# Altium project UL-SWAP-DAQ-1.PrjPcb (part 1 of 2)
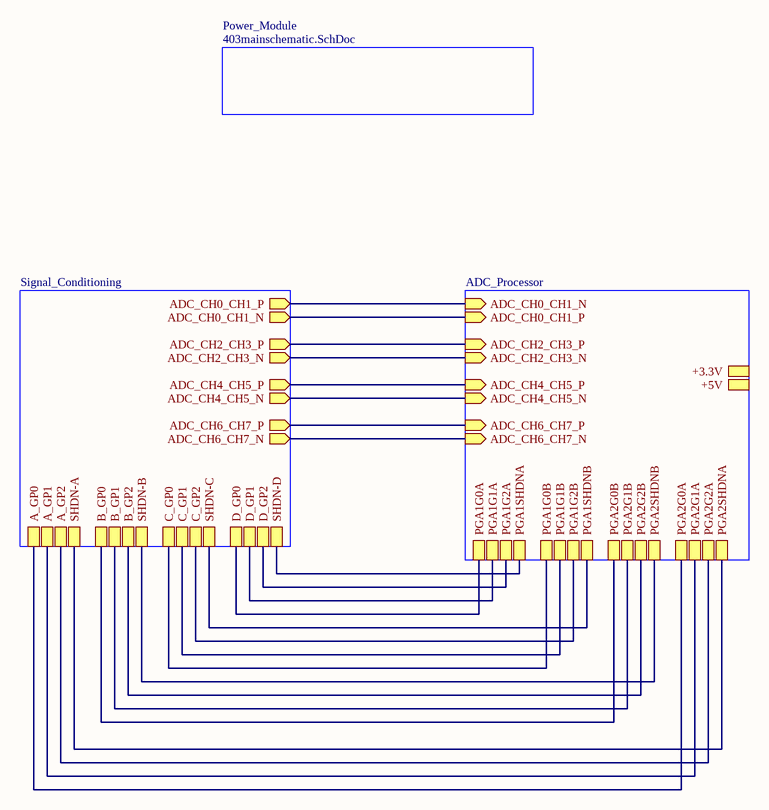
[diagram p0: UL-SWAP-DaQ-Schematic.SchDoc]
14 sheets, 121 parts. Net scope: hierarchical (ports join the sheet entries above them; power ports are global).
Board files: ADC_PIC32_LVDS_DRIVER_Subsystem.PcbDoc, pcb403.PcbDoc, Capstone_Signal_Conditioning_Subsystem_Test_PCB.PcbDoc, UL-SWAP-DAQ-1.PcbDoc
Sheets:
  UL-SWAP-DaQ-Schematic.SchDoc
    Signal_Conditioning = Capstone_Signal_Conditioners_Subsystem_Test_Schematic.SchDoc
      PGA1 = THS7002CPWP_Schematic.SchDoc
      Diff_Amp_1 = LTC6362_Schematic.SchDoc
      PGA2 = THS7002CPWP_Schematic_2.SchDoc
      Diff_Amp_2 = LTC6362_Schematic_2.SchDoc
    ADC_Processor = ADC_PIC32_LVDS_DRIVER_Subsystem.SchDoc
      ADC_Subsystem = ADC_Subsystem.SchDoc
      PIC32_Subsystem = PIC32_Subsystem.SchDoc
      LVDS_Driver_Subsystem = LVDS_Driver_Subsystem.SchDoc
      ICD4_INTERFACE_MODULE = ICD4_Interface_Module.SchDoc
    Power_Module = 403mainschematic.SchDoc
      LMR51420 5V = LMR514205V.SchDoc
      TPS6513x = TPS6513x.SchDoc

## Sheet UL-SWAP-DaQ-Schematic.SchDoc
size A; SheetNumber: 1; SheetTotal: 15

### Sub-sheets
ADC_Processor = ADC_PIC32_LVDS_DRIVER_Subsystem.SchDoc: PGA1G0A, PGA1G1A, PGA1G2A, PGA1SHDNA, PGA1G0B, PGA1G2B, PGA1SHDNB, PGA1G1B, PGA2G0B, PGA2G1B, PGA2G2B, PGA2SHDNB, PGA2G0A, PGA2G1A, PGA2G2A, PGA2SHDNA, +3.3V, +5V, ADC_CH6_CH7_N (in), ADC_CH6_CH7_P (in), ADC_CH4_CH5_N (in), ADC_CH4_CH5_P (in), ADC_CH2_CH3_N (in), ADC_CH2_CH3_P (in), ADC_CH0_CH1_P (in), ADC_CH0_CH1_N (in)
Power_Module = 403mainschematic.SchDoc: no entries
Signal_Conditioning = Capstone_Signal_Conditioners_Subsystem_Test_Schematic.SchDoc: A_GP0, A_GP1, A_GP2, SHDN-A, B_GP0, B_GP1, B_GP2, SHDN-B, C_GP0, C_GP1, C_GP2, SHDN-C, D_GP2, D_GP1, D_GP0, SHDN-D, ADC_CH0_CH1_P (out), ADC_CH0_CH1_N (out), ADC_CH2_CH3_P (out), ADC_CH2_CH3_N (out), ADC_CH4_CH5_N (out), ADC_CH4_CH5_P (out), ADC_CH6_CH7_P (out), ADC_CH6_CH7_N (out)

### Nets
A_GP0: sheet Signal_Conditioning/A_GP0, sheet ADC_Processor/PGA2G0A
A_GP1: sheet Signal_Conditioning/A_GP1, sheet ADC_Processor/PGA2G1A
A_GP2: sheet Signal_Conditioning/A_GP2, sheet ADC_Processor/PGA2G2A
ADC_CH0_CH1_N: sheet Signal_Conditioning/ADC_CH0_CH1_N, sheet ADC_Processor/ADC_CH0_CH1_P
ADC_CH0_CH1_P: sheet Signal_Conditioning/ADC_CH0_CH1_P, sheet ADC_Processor/ADC_CH0_CH1_N
ADC_CH2_CH3_N: sheet Signal_Conditioning/ADC_CH2_CH3_N, sheet ADC_Processor/ADC_CH2_CH3_N
ADC_CH2_CH3_P: sheet Signal_Conditioning/ADC_CH2_CH3_P, sheet ADC_Processor/ADC_CH2_CH3_P
ADC_CH4_CH5_N: sheet Signal_Conditioning/ADC_CH4_CH5_N, sheet ADC_Processor/ADC_CH4_CH5_N
ADC_CH4_CH5_P: sheet Signal_Conditioning/ADC_CH4_CH5_P, sheet ADC_Processor/ADC_CH4_CH5_P
ADC_CH6_CH7_N: sheet Signal_Conditioning/ADC_CH6_CH7_N, sheet ADC_Processor/ADC_CH6_CH7_N
ADC_CH6_CH7_P: sheet Signal_Conditioning/ADC_CH6_CH7_P, sheet ADC_Processor/ADC_CH6_CH7_P
B_GP0: sheet Signal_Conditioning/B_GP0, sheet ADC_Processor/PGA2G0B
B_GP1: sheet Signal_Conditioning/B_GP1, sheet ADC_Processor/PGA2G1B
B_GP2: sheet Signal_Conditioning/B_GP2, sheet ADC_Processor/PGA2G2B
C_GP0: sheet Signal_Conditioning/C_GP0, sheet ADC_Processor/PGA1G0B
C_GP1: sheet Signal_Conditioning/C_GP1, sheet ADC_Processor/PGA1G1B
C_GP2: sheet Signal_Conditioning/C_GP2, sheet ADC_Processor/PGA1G2B
D_GP0: sheet Signal_Conditioning/D_GP0, sheet ADC_Processor/PGA1G0A
D_GP1: sheet Signal_Conditioning/D_GP1, sheet ADC_Processor/PGA1G1A
D_GP2: sheet Signal_Conditioning/D_GP2, sheet ADC_Processor/PGA1G2A
SHDN-A: sheet Signal_Conditioning/SHDN-A, sheet ADC_Processor/PGA2SHDNA
SHDN-B: sheet Signal_Conditioning/SHDN-B, sheet ADC_Processor/PGA2SHDNB
SHDN-C: sheet Signal_Conditioning/SHDN-C, sheet ADC_Processor/PGA1SHDNB
SHDN-D: sheet Signal_Conditioning/SHDN-D, sheet ADC_Processor/PGA1SHDNA

## Sheet Capstone_Signal_Conditioners_Subsystem_Test_Schematic.SchDoc
size A; SheetNumber: 11; SheetTotal: 15
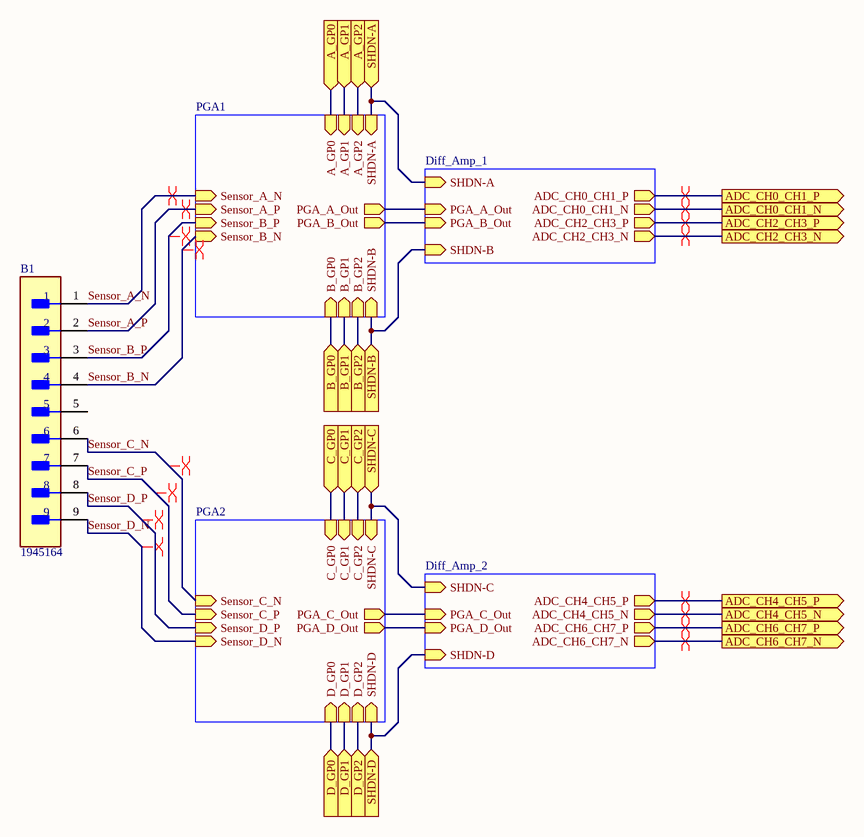
[diagram p1: Capstone_Signal_Conditioners_Subsystem_Test_Schematic.SchDoc]

### Parts
(Parts that share a designator on the sheet are numbered #1, #2 ... from top to bottom, then left to right.)
B1#1  1945164  [FP-4-644456-0-MFG]

### Sub-sheets
Diff_Amp_1 = LTC6362_Schematic.SchDoc: PGA_A_Out (in), PGA_B_Out (in), SHDN-A (in), SHDN-B (in), ADC_CH0_CH1_P (out), ADC_CH0_CH1_N (out), ADC_CH2_CH3_N (out), ADC_CH2_CH3_P (out)
Diff_Amp_2 = LTC6362_Schematic_2.SchDoc: SHDN-C (in), SHDN-D (in), ADC_CH6_CH7_N (out), ADC_CH6_CH7_P (out), ADC_CH4_CH5_N (out), ADC_CH4_CH5_P (out), PGA_C_Out (in), PGA_D_Out (in)
PGA1 = THS7002CPWP_Schematic.SchDoc: Sensor_A_P (in), Sensor_A_N (in), Sensor_B_P (in), Sensor_B_N (in), A_GP0 (in), A_GP1 (in), A_GP2 (in), PGA_A_Out (out), PGA_B_Out (out), B_GP0 (in), B_GP1 (in), B_GP2 (in), SHDN-A (in), SHDN-B (in)
PGA2 = THS7002CPWP_Schematic_2.SchDoc: Sensor_C_P (in), Sensor_C_N (in), Sensor_D_P (in), Sensor_D_N (in), C_GP0 (in), D_GP0 (in), C_GP1 (in), C_GP2 (in), D_GP1 (in), D_GP2 (in), SHDN-C (in), SHDN-D (in), PGA_C_Out (out), PGA_D_Out (out)

### Ports
A_GP0 (in), A_GP1 (in), A_GP2 (in), ADC_CH0_CH1_N (out), ADC_CH0_CH1_P (out), ADC_CH2_CH3_N (out), ADC_CH2_CH3_P (out), ADC_CH4_CH5_N (out), ADC_CH4_CH5_P (out), ADC_CH6_CH7_N (out), ADC_CH6_CH7_P (out), B_GP0 (in), B_GP1 (in), B_GP2 (in), C_GP0 (in), C_GP1 (in), C_GP2 (in), D_GP0 (in), D_GP1 (in), D_GP2 (in), SHDN-A (in), SHDN-B (in), SHDN-C (in), SHDN-D (in)

### Nets
A_GP0: port A_GP0, sheet PGA1/A_GP0
A_GP1: port A_GP1, sheet PGA1/A_GP1
A_GP2: port A_GP2, sheet PGA1/A_GP2
ADC_CH0_CH1_N: port ADC_CH0_CH1_N, sheet Diff_Amp_1/ADC_CH0_CH1_N
ADC_CH0_CH1_P: port ADC_CH0_CH1_P, sheet Diff_Amp_1/ADC_CH0_CH1_P
ADC_CH2_CH3_N: port ADC_CH2_CH3_N, sheet Diff_Amp_1/ADC_CH2_CH3_N
ADC_CH2_CH3_P: port ADC_CH2_CH3_P, sheet Diff_Amp_1/ADC_CH2_CH3_P
ADC_CH4_CH5_N: port ADC_CH4_CH5_N, sheet Diff_Amp_2/ADC_CH4_CH5_N
ADC_CH4_CH5_P: port ADC_CH4_CH5_P, sheet Diff_Amp_2/ADC_CH4_CH5_P
ADC_CH6_CH7_N: port ADC_CH6_CH7_N, sheet Diff_Amp_2/ADC_CH6_CH7_N
ADC_CH6_CH7_P: port ADC_CH6_CH7_P, sheet Diff_Amp_2/ADC_CH6_CH7_P
B_GP0: port B_GP0, sheet PGA1/B_GP0
B_GP1: port B_GP1, sheet PGA1/B_GP1
B_GP2: port B_GP2, sheet PGA1/B_GP2
C_GP0: port C_GP0, sheet PGA2/C_GP0
C_GP1: port C_GP1, sheet PGA2/C_GP1
C_GP2: port C_GP2, sheet PGA2/C_GP2
D_GP0: port D_GP0, sheet PGA2/D_GP0
D_GP1: port D_GP1, sheet PGA2/D_GP1
D_GP2: port D_GP2, sheet PGA2/D_GP2
PGA_A_Out: sheet PGA1/PGA_A_Out, sheet Diff_Amp_1/PGA_A_Out
PGA_B_Out: sheet PGA1/PGA_B_Out, sheet Diff_Amp_1/PGA_B_Out
PGA_C_Out: sheet PGA2/PGA_C_Out, sheet Diff_Amp_2/PGA_C_Out
PGA_D_Out: sheet PGA2/PGA_D_Out, sheet Diff_Amp_2/PGA_D_Out
Sensor_A_N: B1#1.1 ; sheet PGA1/Sensor_A_N
Sensor_A_P: B1#1.2 ; sheet PGA1/Sensor_A_P
Sensor_B_N: B1#1.4 ; sheet PGA1/Sensor_B_N
Sensor_B_P: B1#1.3 ; sheet PGA1/Sensor_B_P
Sensor_C_N: B1#1.6 ; sheet PGA2/Sensor_C_N
Sensor_C_P: B1#1.7 ; sheet PGA2/Sensor_C_P
Sensor_D_N: B1#1.9 ; sheet PGA2/Sensor_D_N
Sensor_D_P: B1#1.8 ; sheet PGA2/Sensor_D_P
SHDN-A: port SHDN-A, sheet PGA1/SHDN-A, sheet Diff_Amp_1/SHDN-A
SHDN-B: port SHDN-B, sheet PGA1/SHDN-B, sheet Diff_Amp_1/SHDN-B
SHDN-C: port SHDN-C, sheet PGA2/SHDN-C, sheet Diff_Amp_2/SHDN-C
SHDN-D: port SHDN-D, sheet PGA2/SHDN-D, sheet Diff_Amp_2/SHDN-D

Not connected (* = marked no-connect by the designer): B1#1 5

### Layout directives
differential pair: ADC_CH0_CH1_N, ADC_CH0_CH1_P, ADC_CH2_CH3_N, ADC_CH2_CH3_P, ADC_CH4_CH5_N, ADC_CH4_CH5_P, ADC_CH6_CH7_N, ADC_CH6_CH7_P, Sensor_A_N, Sensor_A_P, Sensor_B_N, Sensor_B_P, Sensor_C_N, Sensor_C_P, Sensor_D_N, Sensor_D_P

### Library data of the parts
B1#1 = CMP-03369-000038-1: CONN HEADER VERT 9POS 3.5MM; Manufacturer Part Number: 4-644456-0; Manufacturer: TE Connectivity; Pitch: 2.54mm; Current Rating: 5A; Conn Gender: Male; Number Of Contacts: 10; Conn Orientation: Vertical; Voltage Rating: 250V; Number Of Rows: 1; Device Class L3: unset; Octopart: https://octopart.com/4-644456-0-te+connectivity-39514173; Mouser Description: Headers & Wire Housings NARROW FLT HDR 10P Straight Post; ComponentLink2Description: Datasheet; Height: 0.408inch; Package: 4-644456-0; RoHS: TRUE; Temperature Range High: +105°C; Digikey Description: CONN HEADER VERT 10POS 2.54MM; Temperature: -55°C to +105°C; Device Class L2: Headers and Wire Housings; Automotive: No; Lead Free: Yes; Contact Material: Tin; Temperature Range Low: -55°C; Footprint Url: https://www.te.com/commerce/DocumentDelivery/DDEController?Action=showdoc&DocId=Customer+Drawing%7F644456%7FD2%7Fpdf%7FEnglish%7FENG_CD_644456_D2.pdf%7F4-644456-0; Device Class L1: Connectors; Category: Conn; ComponentLink2URL: https://www.te.com/commerce/DocumentDelivery/DDEController?Action=showdoc&DocId=Data+Sheet%7F82056_MTA%7F0818%7Fpdf%7FEnglish%7FENG_DS_82056_MTA_0818.pdf%7F4-644456-0

## Sheet THS7002CPWP_Schematic.SchDoc
size A; SheetNumber: 12; SheetTotal: 15
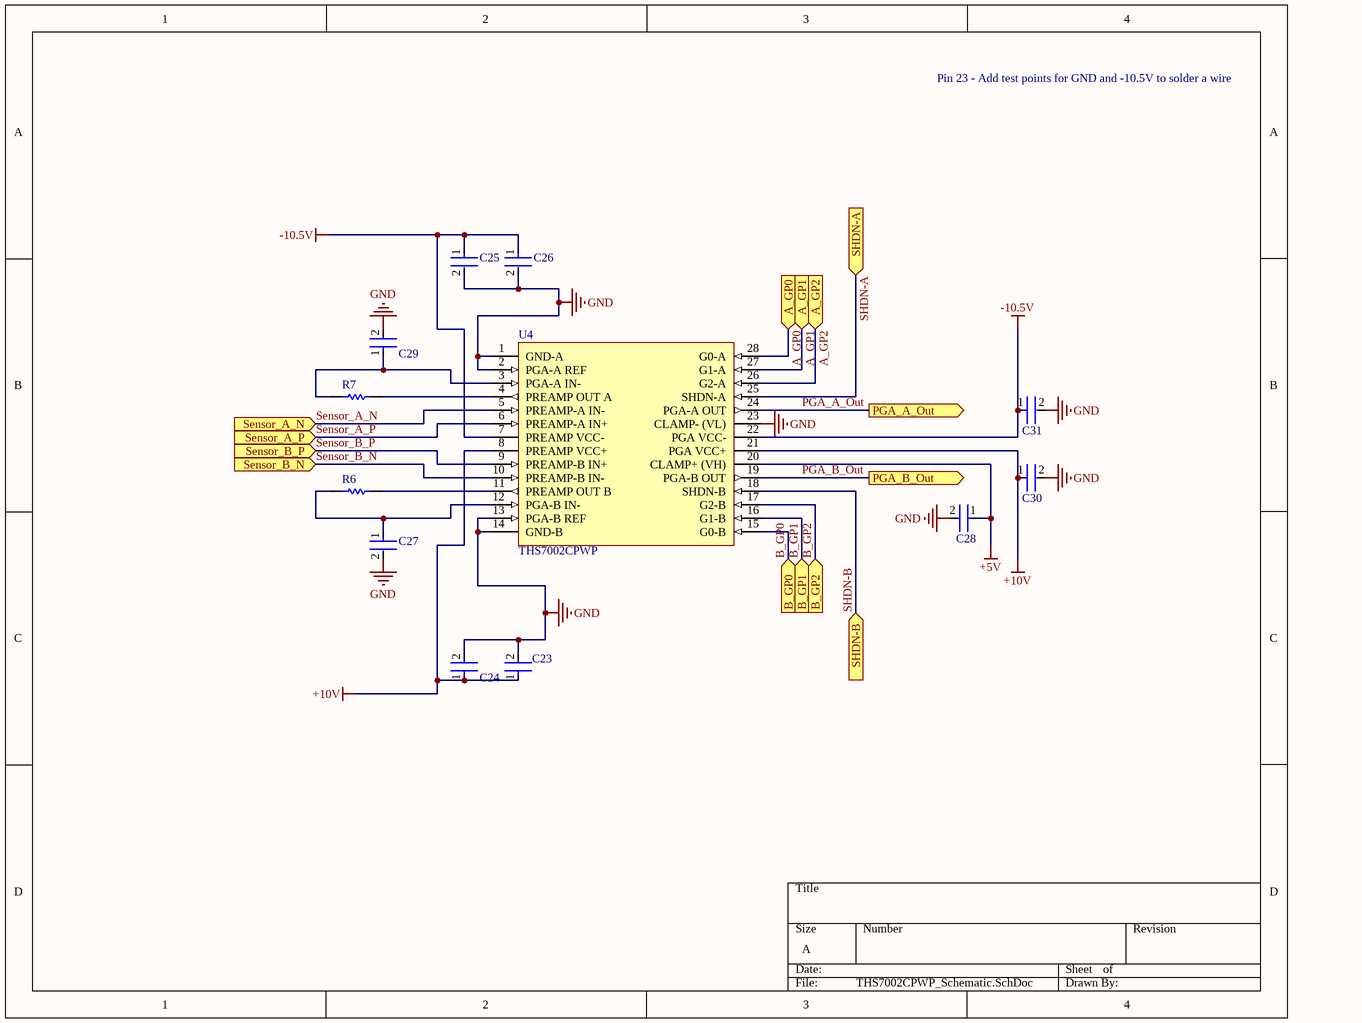
[diagram p2: THS7002CPWP_Schematic.SchDoc]

### Parts
(Parts that share a designator on the sheet are numbered #1, #2 ... from top to bottom, then left to right.)
C23  C2012JB1A685K060AC  [FP-C2012-060-0_2-IPC_A]  (value not drawn)
C24  CC0603KRX7R7BB104  [FP-CC0603-DA-MFG]  (value not drawn)
C25  CC0603KRX7R7BB104  [FP-CC0603-DA-MFG]  (value not drawn)
C26  C2012JB1A685K060AC  [FP-C2012-060-0_2-IPC_A]  (value not drawn)
C27  GRM3195C1H163JA01D  [FP-GRM319-0_15-IPC_A]  (value not drawn)
C28  C2012JB1A685K060AC  [FP-C2012-060-0_2-IPC_A]  (value not drawn)
C29  GRM3195C1H163JA01D  [FP-GRM319-0_15-IPC_A]  (value not drawn)
C30  CC0603KRX7R7BB104  [FP-CC0603-DA-MFG]  (value not drawn)
C31  CC0603KRX7R7BB104  [FP-CC0603-DA-MFG]  (value not drawn)
R6#1  CRCW08050000Z0EA  [RESC2013X50X30LL20T20]  (value not drawn)
R7#1  CRCW08050000Z0EA  [RESC2013X50X30LL20T20]  (value not drawn)
U4  THS7002CPWP  [PWP0028E_M]

### Ports
A_GP0 (in), A_GP1 (in), A_GP2 (in), B_GP0 (in), B_GP1 (in), B_GP2 (in), PGA_A_Out (out), PGA_B_Out (out), Sensor_A_N (in), Sensor_A_P (in), Sensor_B_N (in), Sensor_B_P (in), SHDN-A (in), SHDN-B (in)

### Nets
+5V: C28.1 U4.20(CLAMP+_(VH))
+10V: C23.1 C24.1 C30.1 U4.8(PREAMP_VCC+) U4.21(PGA_VCC+)
-10.5V: C25.1 C26.1 C31.1 U4.7(PREAMP_VCC-) U4.22(PGA_VCC-)
GND: C23.2 C24.2 C25.2 C26.2 C27.2 C28.2 C29.2 C30.2 C31.2 U4.1(GND-A) U4.2(PGA-A_REF) U4.13(PGA-B_REF) U4.14(GND-B) U4.23(CLAMP-_(VL))
A_GP0: U4.28(G0-A) ; port A_GP0
A_GP1: U4.27(G1-A) ; port A_GP1
A_GP2: U4.26(G2-A) ; port A_GP2
B_GP0: U4.15(G0-B) ; port B_GP0
B_GP1: U4.16(G1-B) ; port B_GP1
B_GP2: U4.17(G2-B) ; port B_GP2
PGA_A_Out: U4.24(PGA-A_OUT) ; port PGA_A_Out
PGA_B_Out: U4.19(PGA-B_OUT) ; port PGA_B_Out
Sensor_A_N: U4.5(PREAMP-A_IN-) ; port Sensor_A_N
Sensor_A_P: U4.6(PREAMP-A_IN+) ; port Sensor_A_P
Sensor_B_N: U4.10(PREAMP-B_IN-) ; port Sensor_B_N
Sensor_B_P: U4.9(PREAMP-B_IN+) ; port Sensor_B_P
SHDN-A: U4.25(SHDN-A) ; port SHDN-A
SHDN-B: U4.18(SHDN-B) ; port SHDN-B
NetC27_1: C27.1 R6#1.1 U4.12(PGA-B_IN-)
NetC29_1: C29.1 R7#1.1 U4.3(PGA-A_IN-)
NetR6#1_2: R6#1.2 U4.11(PREAMP_OUT_B)
NetR7#1_2: R7#1.2 U4.4(PREAMP_OUT_A)

### Notes on the sheet
- Pin 23 - Add test points for GND and -10.5V to solder a wire

### Library data of the parts
C23 C26 C28 = CMP-08246-004641-1: Multilayer Ceramic Capacitors 6.8μF ±10% 10V JB SMD 0805; Capacitance: 6.8uF; RoHS Compliant: Yes; Case Code (Metric): 5032; Case/Package: 0805; Voltage Rating: 10V; Width: 0.049inch; Min Operating Temperature: -25°C; Mount: Surface Mount; Voltage Rating (DC): 10V; Dielectric Material: Ceramic; Case Code (Imperial): 2012; Package Quantity: 4000; Lead Free: Lead Free; Packaging: Tape and Reel; Length: 0.079inch; Tolerance: 10%; Thickness: 0.028inch; Max Operating Temperature: 85°C; Series: C
C24 C25 C30 C31 = CMP-2000-05002-2: CAP CER 0.1UF 16V X7R 0603; Manufacturer: YAGEO; Tolerance: 0.1; Value: 100 nF; Temperature Coefficient: 15%; Material: Ceramic; Voltage Rating: 16 V; Package: CC0603-DA; ComponentLink2Description: Datasheet; Octopart: https://octopart.com/cc0603krx7r7bb104-yageo-192941; Temperature Range High: +125°C; Digikey Description: CAP CER 0.1UF 16V X7R 0603; Voltage: 16 V; Device Class L2: Capacitors; Height: 0.9mm; Temperature: -55°C to +125°C; Manufacturer Part Number: CC0603KRX7R7BB104; Device Class L1: Passive Components; Device Class L3: Ceramic Capacitors; ComponentLink2URL: http://www.yageo.com/documents/recent/UPY-GPHC_X7R_6.3V-to-50V_18.pdf; Footprint Url: http://www.yageo.com/exep/pages/download/literatures/UPY-C_GEN_24.pdf; RoHS: TRUE; Temperature Range Low: -55°C; Temperature Characteristic: X7R; Lead Free: Yes; Capacitance: 100 nF; Category: Cap; Mouser Description: Multilayer Ceramic Capacitor, CC Series, 0.1 - F, - 10%, X7R, 16 V, 0603 [1608 Metric]; Automotive: No
C27 C29 = CMP-06035-007665-1: Chip Multilayer Ceramic Capacitors for General Purpose, 1206, 16000pF, C0G, 30ppm/°C, 5%, 50V; Capacitance: 16nF; Tolerance: 5%; Case Code (Metric): 3216; Length: 3.2mm; Package Quantity: 4000; Mount: Surface Mount; Voltage Rating (DC): 50V; Voltage Rating: 50V; Case Code (Imperial): 1206; Height: 0.85mm; Min Operating Temperature: -55°C; Max Operating Temperature: 125°C; Termination: SMD/SMT; Width: 0.063inch; Radiation Hardening: No; Depth: 1.6mm; Thickness: 0.037inch; Dielectric: C0G; Case/Package: 1206; Packaging: Tape and Reel
R6#1 R7#1 = CMP-2001-04896-1: Manufacturer: Vishay Dale; Part Number: CRCW08050000Z0EA
U4 = CMP-0988-00132-2: 70-MHz High-Speed Programmable-Gain Amplifier, Dual, 0 to 70 degC, 28-pin SOP (PWP28), Green (RoHS & no Sb/Br); Manufacturer: Texas Instruments; Disable: TRUE; BW @ Acl(MHz): 100; Vs(Min)(V): 9; Vs(Max)(V): 32; Number of Channels: 2; Vio(Max)(mV): 7; Iib(Max)(nA): 6000; SubFamily: Variable Gain Amplifier; Vn at Flatband(Typ)(nV/rtHz): 1.7; Slew Rate(Typ)(V/us): 85; ComponentLink1Description: Manufacturer URL; Code_JEDEC: MO-153; PackageVersion: 4073225-6/I, 05/2011; PackageReference: PWP0028E; Eco-Plan: Green (RoHS & no Sb/Br); ComponentLink2URL: http://www.ti.com/general/docs/lit/getliterature.tsp?genericPartNumber=THS7002&fileType=pdf; PackageDescription: 28-Pin Plastic Small Outline, Body 4.4 x 9.7 mm, Pitch 0.65 mm; DatasheetVersion: SLOS214C; ComponentLink3URL: http://www.ti.com/litv/pdf/mpds373; ComponentLink3Description: Package Specification; ComponentLink1URL: http://www.ti.com/; ComponentLink2Description: Datasheet; Mounting Technology: Surface Mount; PartNumber: THS7002CPWP

## Sheet LTC6362_Schematic.SchDoc
size A; SheetNumber: 13; SheetTotal: 15
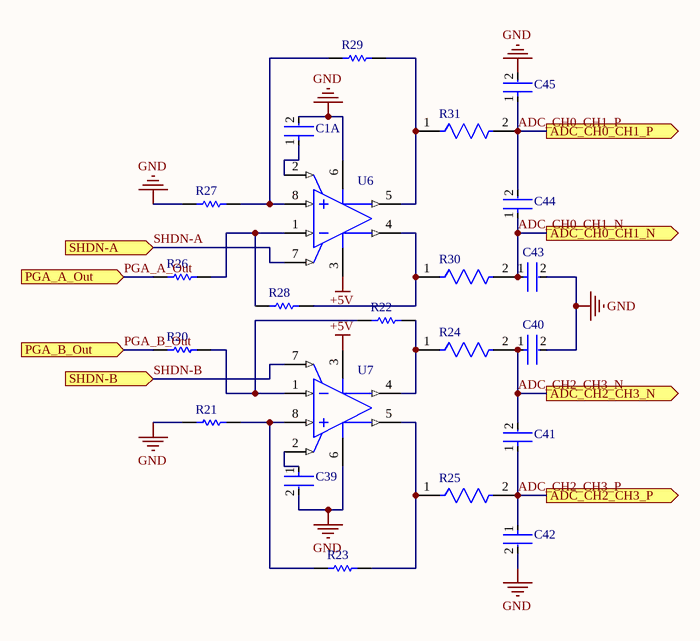
[diagram p3: LTC6362_Schematic.SchDoc]

### Parts
(Parts that share a designator on the sheet are numbered #1, #2 ... from top to bottom, then left to right.)
C1A  GQM1875C2ER10BB12D  [FP-GQM187-0_15-MFG]  (value not drawn)
C39  GQM1875C2ER10BB12D  [FP-GQM187-0_15-MFG]  (value not drawn)
C40  CC0603KRX7R9BB392  [FP-CC0603-DA-MFG]  (value not drawn)
C41  CC0603KRX7R9BB392  [FP-CC0603-DA-MFG]  (value not drawn)
C42  CC0603KRX7R9BB392  [FP-CC0603-DA-MFG]  (value not drawn)
C43  CC0603KRX7R9BB392  [FP-CC0603-DA-MFG]  (value not drawn)
C44  CC0603KRX7R9BB392  [FP-CC0603-DA-MFG]  (value not drawn)
C45  CC0603KRX7R9BB392  [FP-CC0603-DA-MFG]  (value not drawn)
R20  ERJ-6ENF1241V  [RESC2013X70X40LL20T20]  (value not drawn)
R21  ERJ-6ENF1241V  [RESC2013X70X40LL20T20]  (value not drawn)
R22  RC0805FR-071KL  [RESC2013X60X35ML10T20]  (value not drawn)
R23  RC0805FR-071KL  [RESC2013X60X35ML10T20]  (value not drawn)
R24  CRCW060335K7FKEA  [FP-CRCW0603-e3-IPC_C]  (value not drawn)
R25  CRCW060335K7FKEA  [FP-CRCW0603-e3-IPC_C]  (value not drawn)
R26  ERJ-6ENF1241V  [RESC2013X70X40LL20T20]  (value not drawn)
R27  ERJ-6ENF1241V  [RESC2013X70X40LL20T20]  (value not drawn)
R28  RC0805FR-071KL  [RESC2013X60X35ML10T20]  (value not drawn)
R29  RC0805FR-071KL  [RESC2013X60X35ML10T20]  (value not drawn)
R30  CRCW060335K7FKEA  [FP-CRCW0603-e3-IPC_C]  (value not drawn)
R31  CRCW060335K7FKEA  [FP-CRCW0603-e3-IPC_C]  (value not drawn)
U6#1  LTC6362HMS8#PBF  [LT-MS8-8_L]  (value not drawn)
U7  LTC6362HMS8#PBF  [LT-MS8-8_L]  (value not drawn)

### Ports
ADC_CH0_CH1_N (out), ADC_CH0_CH1_P (out), ADC_CH2_CH3_N (out), ADC_CH2_CH3_P (out), PGA_A_Out (in), PGA_B_Out (in), SHDN-A (in), SHDN-B (in)

### Nets
+5V: U6#1.3(V+) U7.3(V+)
GND: C1A.2 C39.2 C40.2 C42.2 C43.2 C45.2 R21.1 R27.1 U6#1.6(V-) U7.6(V-)
ADC_CH0_CH1_N: C43.1 C44.1 R30.2 ; port ADC_CH0_CH1_N
ADC_CH0_CH1_P: C44.2 C45.1 R31.2 ; port ADC_CH0_CH1_P
ADC_CH2_CH3_N: C40.1 C41.2 R24.2 ; port ADC_CH2_CH3_N
ADC_CH2_CH3_P: C41.1 C42.1 R25.2 ; port ADC_CH2_CH3_P
PGA_A_Out: R26.1 ; port PGA_A_Out
PGA_B_Out: R20.1 ; port PGA_B_Out
SHDN-A: U6#1.7(~{SHDN}) ; port SHDN-A
SHDN-B: U7.7(~{SHDN}) ; port SHDN-B
NetC1A_1: C1A.1 U6#1.2(VOCM)
NetC39_1: C39.1 U7.2(VOCM)
NetR20_2: R20.2 R22.1 U7.1(-IN)
NetR21_2: R21.2 R23.1 U7.8(+IN)
NetR22_2: R22.2 R24.1 U7.4(+OUT)
NetR23_2: R23.2 R25.1 U7.5(-OUT)
NetR26_2: R26.2 R28.1 U6#1.1(-IN)
NetR27_2: R27.2 R29.1 U6#1.8(+IN)
NetR28_2: R28.2 R30.1 U6#1.4(+OUT)
NetR29_2: R29.2 R31.1 U6#1.5(-OUT)

### Library data of the parts
C1A C39 = CMP-06035-052255-1: Ceramic Capacitor 0.1pF ±0.1pF 250VDC C0G 0603 Paper T/R; Voltage Rating: 250V; Width: 0.031inch; Length: 1.6mm; Max Operating Temperature: 125°C; Min Operating Temperature: -55°C; Height: 0.7mm; Dielectric: C0G; Termination: SMD/SMT; Depth: 0.8mm; Case/Package: 0603; Package Quantity: 4000; Radiation Hardening: No; Case Code (Metric): 1608; Thickness: 0.031inch; Capacitance: 0.1pF; Case Code (Imperial): 0603; Voltage Rating (DC): 250V; Packaging: Tape and Reel; Mount: Surface Mount
C40-C45 = CMP-03422-000635-2: CAP CER 3900PF 50V X7R 0603; Tolerance: 10%; Dielectric Material: Ceramic; Capacitance: 3.9nF; Insulation Resistance: 100GR; Height: 0.8mm; Voltage Rating: 50V; Termination: SMD/SMT; REACH SVHC: No SVHC; Resistor Type: Ceramic; Radiation Hardening: No; Case Code (Imperial): 0603; Voltage: 50V; Series: CC; Mount: Surface Mount; Length: 1.6mm; RoHS Compliant: Yes; Lead Free: Lead Free; Width: 0.8mm; Package Quantity: 4000; Packaging: Tape and Reel; Dielectric: X7R; Voltage Rating (DC): 50V; Min Operating Temperature: -55°C; Depth: 0.8mm; Halogen Free: Halogen Free; Case/Package: 0603; Thickness: 0.035inch; Number of Pins: 2; Max Operating Temperature: 125°C; Case Code (Metric): 1608; Construction: Flat
R20 R21 R26 R27 = CMP-2001-04406-1: Manufacturer: Panasonic; Part Number: ERJ-6ENF1241V
R22 R23 R28 R29 = CMP-2100-03671-1: Chip Resistor, 1 KOhm, +/- 1%, 125 mW, -55 to 155 degC, 0805 (2012 Metric), RoHS, Tape and Reel; Manufacturer: Yageo; Temperature Coefficient: 100ppm/degreesC; Voltage Rating (DC): 150V; Max Power Dissipation: 125mW; Resistance: 1KOhm; Number of Pins: 2; Number of Terminations: 2; Datasheet URL: http://www.yageo.com/NewPortal/yageodocoutput?fileName=/pdf/R-Chip/PYu-RC_Group_51_RoHS_L_5.pdf; Length: 0.079inch; Package Description: 2-Pin Surface Mounted Device, Body 2 x 1.25 mm; Depth: 1.25mm; Height: 0.024inch; Military Standard: Not; Case/Package: 0805; Package Reference: 0805; RoHSCompliant: true; Lead Free: LeadFree; Packaging: TapeandReel; Package Quantity: 1; Datasheet Version: Rev. 5, 10/2016; Tolerance: 1%; Min Operating Temperature: -55degC; Voltage Rating: 150V; Composition: ThickFilm; Case Code (Imperial): 0805; Power Rating: 125mW; Width: 0.049inch; Case Code (Metric): 2012; Manufacturer URL: http://www.yageo.com/; Max Operating Temperature: 155degC; REACH SVHC: Unknown; Termination: SMD/SMT
R24 R25 R30 R31 = CMP-2000-03264-2: RES Thick Film, 35.7kΩ, 1%, 0.1W, 100ppm/°C, 0603; Max Power Dissipation: 100mW; Voltage Rating: 75V; Resistance: 35.7kR; Weight: 7.1E-05oz; Termination: Solder; Max Operating Temperature: 155°C; Military Standard: Not; Height: 0.45mm; Temperature Coefficient: 100ppm/°C; Contact Plating: Tin; Packaging: Tape and Reel; Radiation Hardening: No; Depth: 0.85mm; Number of Pins: 2; Length: 1.55mm; Composition: Thick Film; Case Code (Metric): 1608; Package Quantity: 10; Width: 0.033inch; Number of Terminations: 2; Power Rating: 100mW; Case/Package: 0603; Case Code (Imperial): 0603; Features: Automotive AEC-Q200; Tolerance: 1%; Min Operating Temperature: -55°C
U6#1 U7 = CMP-0359-00920-2: Single Channel, Precision, Low Power Differential Operational Amplifier / SAR ADC Driver, RRIO, 180 MHz Typical GBW, 45 V/us Typical SR, 2.8 to 5.25 V, 8-Pin SOP (MS8-8), High Temperature / Automotive, Pb-Free; Manufacturer: Linear Technology; Vs Max (V): 5.25; Is (mA) Typical: 0.9; SR (V/us) Typical: 45; Channels (#): 1; GBW (MHz) Typical: 180; Vos (mV) Typical: 0.05; Vs Min (V): 2.8; PartNumber: LTC6362HMS8#PBF; PackageDescription: 8-Lead Plastic Small Outline, Body 3.9 x 4.9 mm, Pitch 1.27 mm; ComponentLink2Description: Datasheet; ComponentLink3URL: http://cds.linear.com/docs/en/packaging/05081610_G_SO8.pdf; ComponentLink1Description: Manufacturer URL; PackageReference: LT-MS8-8; ComponentLink2URL: http://cds.linear.com/docs/en/datasheet/6362fa.pdf; PackageVersion: Rev G; Mounting Technology: Surface Mount; Linear Technology Part Number: LTC6362; DatasheetVersion: Rev. A; RevisionNote: URLs updated; RoHS: Pb-Free; ComponentLink1URL: http://www.linear.com/; Type: DIFF; ComponentLink3Description: Package Specification

## Sheet THS7002CPWP_Schematic_2.SchDoc
size A; SheetNumber: 15; SheetTotal: 15
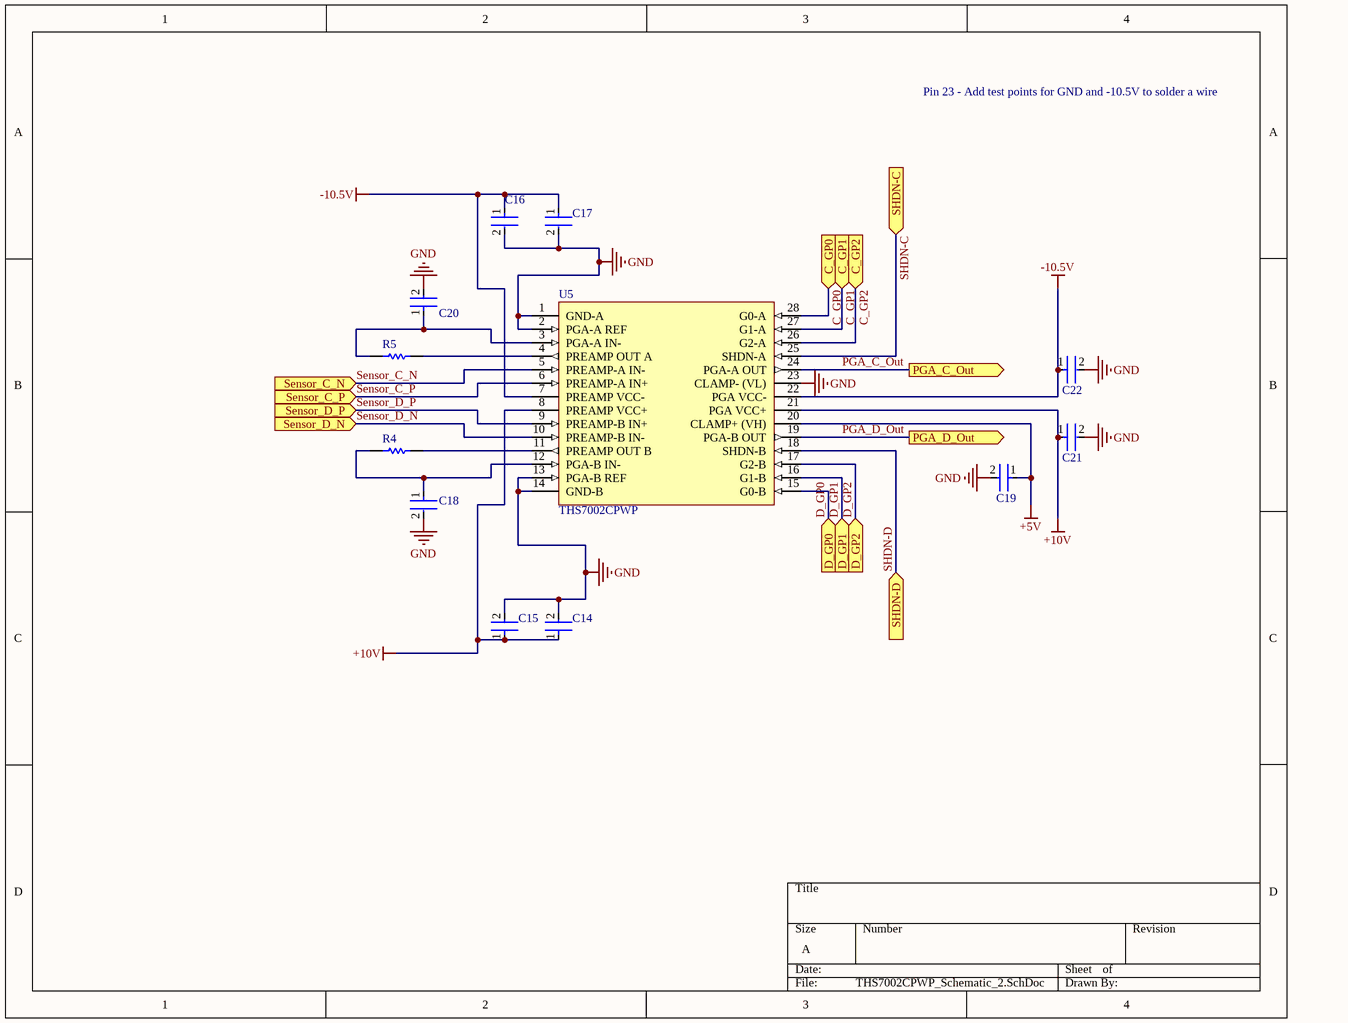
[diagram p4: THS7002CPWP_Schematic_2.SchDoc]

### Parts
(Parts that share a designator on the sheet are numbered #1, #2 ... from top to bottom, then left to right.)
C14#1  C2012JB1A685K060AC  [FP-C2012-060-0_2-IPC_A]  (value not drawn)
C15#1  CC0603KRX7R7BB104  [FP-CC0603-DA-MFG]  (value not drawn)
C16#1  CC0603KRX7R7BB104  [FP-CC0603-DA-MFG]  (value not drawn)
C17#1  C2012JB1A685K060AC  [FP-C2012-060-0_2-IPC_A]  (value not drawn)
C18#1  GRM3195C1H163JA01D  [FP-GRM319-0_15-IPC_A]  (value not drawn)
C19#1  C2012JB1A685K060AC  [FP-C2012-060-0_2-IPC_A]  (value not drawn)
C20#1  GRM3195C1H163JA01D  [FP-GRM319-0_15-IPC_A]  (value not drawn)
C21#1  C2012JB1A685K060AC  [FP-C2012-060-0_2-IPC_A]  (value not drawn)
C22  C2012JB1A685K060AC  [FP-C2012-060-0_2-IPC_A]  (value not drawn)
R4#1  CRCW08050000Z0EA  [RESC2013X50X30LL20T20]  (value not drawn)
R5#1  CRCW08050000Z0EA  [RESC2013X50X30LL20T20]  (value not drawn)
U5  THS7002CPWP  [PWP0028E_M]

### Ports
C_GP0 (in), C_GP1 (in), C_GP2 (in), D_GP0 (in), D_GP1 (in), D_GP2 (in), PGA_C_Out (out), PGA_D_Out (out), Sensor_C_N (in), Sensor_C_P (in), Sensor_D_N (in), Sensor_D_P (in), SHDN-C (in), SHDN-D (in)

### Nets
+5V: C19#1.1 U5.20(CLAMP+_(VH))
+10V: C14#1.1 C15#1.1 C21#1.1 U5.8(PREAMP_VCC+) U5.21(PGA_VCC+)
-10.5V: C16#1.1 C17#1.1 C22.1 U5.7(PREAMP_VCC-) U5.22(PGA_VCC-)
GND: C14#1.2 C15#1.2 C16#1.2 C17#1.2 C18#1.2 C19#1.2 C20#1.2 C21#1.2 C22.2 U5.1(GND-A) U5.2(PGA-A_REF) U5.13(PGA-B_REF) U5.14(GND-B) U5.23(CLAMP-_(VL))
C_GP0: U5.28(G0-A) ; port C_GP0
C_GP1: U5.27(G1-A) ; port C_GP1
C_GP2: U5.26(G2-A) ; port C_GP2
D_GP0: U5.15(G0-B) ; port D_GP0
D_GP1: U5.16(G1-B) ; port D_GP1
D_GP2: U5.17(G2-B) ; port D_GP2
PGA_C_Out: U5.24(PGA-A_OUT) ; port PGA_C_Out
PGA_D_Out: U5.19(PGA-B_OUT) ; port PGA_D_Out
Sensor_C_N: U5.5(PREAMP-A_IN-) ; port Sensor_C_N
Sensor_C_P: U5.6(PREAMP-A_IN+) ; port Sensor_C_P
Sensor_D_N: U5.10(PREAMP-B_IN-) ; port Sensor_D_N
Sensor_D_P: U5.9(PREAMP-B_IN+) ; port Sensor_D_P
SHDN-C: U5.25(SHDN-A) ; port SHDN-C
SHDN-D: U5.18(SHDN-B) ; port SHDN-D
NetC18#1_1: C18#1.1 R4#1.1 U5.12(PGA-B_IN-)
NetC20#1_1: C20#1.1 R5#1.1 U5.3(PGA-A_IN-)
NetR4#1_2: R4#1.2 U5.11(PREAMP_OUT_B)
NetR5#1_2: R5#1.2 U5.4(PREAMP_OUT_A)

### Notes on the sheet
- Pin 23 - Add test points for GND and -10.5V to solder a wire

### Library data of the parts
C14#1 C17#1 C19#1 C21#1 C22 = CMP-08246-004641-1: as C23 on sheet THS7002CPWP_Schematic; RoHS Compliant: Yes; Case Code (Metric): 5032; Case/Package: 0805; Voltage Rating: 10V; Width: 0.049inch; Min Operating Temperature: -25°C; Mount: Surface Mount; Voltage Rating (DC): 10V; Dielectric Material: Ceramic; Case Code (Imperial): 2012; Package Quantity: 4000; Lead Free: Lead Free; Packaging: Tape and Reel; Length: 0.079inch; Tolerance: 10%; Thickness: 0.028inch; Max Operating Temperature: 85°C; Series: C
C15#1 C16#1 = CMP-2000-05002-2: as C24 on sheet THS7002CPWP_Schematic; Voltage Rating: 16 V; Package: CC0603-DA; ComponentLink2Description: Datasheet; Octopart: https://octopart.com/cc0603krx7r7bb104-yageo-192941; Temperature Range High: +125°C; Digikey Description: CAP CER 0.1UF 16V X7R 0603; Voltage: 16 V; Device Class L2: Capacitors; Height: 0.9mm; Temperature: -55°C to +125°C; Manufacturer Part Number: CC0603KRX7R7BB104; Device Class L1: Passive Components; Device Class L3: Ceramic Capacitors; ComponentLink2URL: http://www.yageo.com/documents/recent/UPY-GPHC_X7R_6.3V-to-50V_18.pdf; Footprint Url: http://www.yageo.com/exep/pages/download/literatures/UPY-C_GEN_24.pdf; RoHS: TRUE; Temperature Range Low: -55°C; Temperature Characteristic: X7R; Lead Free: Yes; Capacitance: 100 nF; Category: Cap; Mouser Description: Multilayer Ceramic Capacitor, CC Series, 0.1 - F, - 10%, X7R, 16 V, 0603 [1608 Metric]; Automotive: No
C18#1 C20#1 = CMP-06035-007665-1: as C27 on sheet THS7002CPWP_Schematic; Tolerance: 5%; Case Code (Metric): 3216; Length: 3.2mm; Package Quantity: 4000; Mount: Surface Mount; Voltage Rating (DC): 50V; Voltage Rating: 50V; Case Code (Imperial): 1206; Height: 0.85mm; Min Operating Temperature: -55°C; Max Operating Temperature: 125°C; Termination: SMD/SMT; Width: 0.063inch; Radiation Hardening: No; Depth: 1.6mm; Thickness: 0.037inch; Dielectric: C0G; Case/Package: 1206; Packaging: Tape and Reel
R4#1 R5#1 = CMP-2001-04896-1: Manufacturer: Vishay Dale; Part Number: CRCW08050000Z0EA
U5 = CMP-0988-00132-2: as U4 on sheet THS7002CPWP_Schematic; ComponentLink1Description: Manufacturer URL; Code_JEDEC: MO-153; PackageVersion: 4073225-6/I, 05/2011; PackageReference: PWP0028E; Eco-Plan: Green (RoHS & no Sb/Br); ComponentLink2URL: http://www.ti.com/general/docs/lit/getliterature.tsp?genericPartNumber=THS7002&fileType=pdf; PackageDescription: 28-Pin Plastic Small Outline, Body 4.4 x 9.7 mm, Pitch 0.65 mm; DatasheetVersion: SLOS214C; ComponentLink3URL: http://www.ti.com/litv/pdf/mpds373; ComponentLink3Description: Package Specification; ComponentLink1URL: http://www.ti.com/; ComponentLink2Description: Datasheet; Mounting Technology: Surface Mount; PartNumber: THS7002CPWP

## Sheet LTC6362_Schematic_2.SchDoc
size A; SheetNumber: 14; SheetTotal: 15
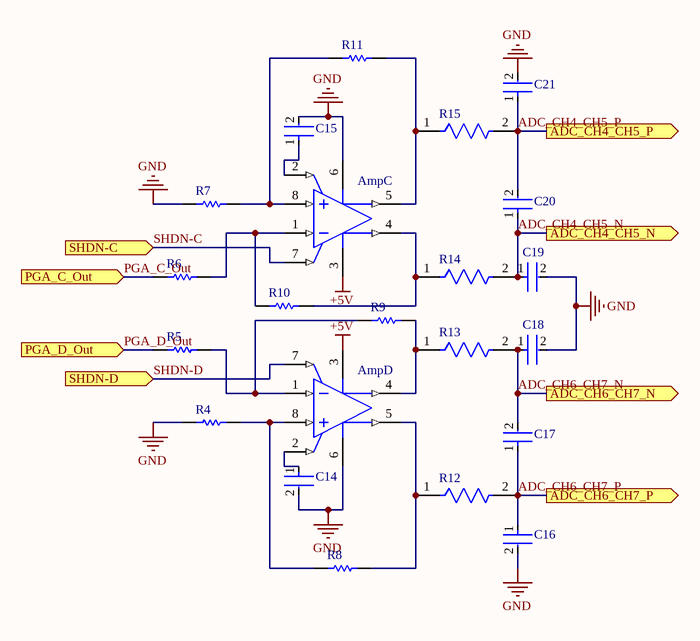
[diagram p5: LTC6362_Schematic_2.SchDoc]

### Parts
(Parts that share a designator on the sheet are numbered #1, #2 ... from top to bottom, then left to right.)
AmpC  LTC6362HMS8#PBF  [LT-MS8-8_L]  (value not drawn)
AmpD  LTC6362HMS8#PBF  [LT-MS8-8_L]  (value not drawn)
C14#2  GQM1875C2ER10BB12D  [FP-GQM187-0_15-MFG]  (value not drawn)
C15#2  GQM1875C2ER10BB12D  [FP-GQM187-0_15-MFG]  (value not drawn)
C16#2  CC0603KRX7R9BB392  [FP-CC0603-DA-MFG]  (value not drawn)
C17#2  CC0603KRX7R9BB392  [FP-CC0603-DA-MFG]  (value not drawn)
C18#2  CC0603KRX7R9BB392  [FP-CC0603-DA-MFG]  (value not drawn)
C19#2  CC0603KRX7R9BB392  [FP-CC0603-DA-MFG]  (value not drawn)
C20#2  CC0603KRX7R9BB392  [FP-CC0603-DA-MFG]  (value not drawn)
C21#2  CC0603KRX7R9BB392  [FP-CC0603-DA-MFG]  (value not drawn)
R4#2  ERJ-6ENF1241V  [RESC2013X70X40LL20T20]  (value not drawn)
R5#2  ERJ-6ENF1241V  [RESC2013X70X40LL20T20]  (value not drawn)
R6#2  ERJ-6ENF1241V  [RESC2013X70X40LL20T20]  (value not drawn)
R7#2  ERJ-6ENF1241V  [RESC2013X70X40LL20T20]  (value not drawn)
R8  RC0805FR-071KL  [RESC2013X60X35ML10T20]  (value not drawn)
R9  RC0805FR-071KL  [RESC2013X60X35ML10T20]  (value not drawn)
R10  RC0805FR-071KL  [RESC2013X60X35ML10T20]  (value not drawn)
R11  RC0805FR-071KL  [RESC2013X60X35ML10T20]  (value not drawn)
R12  CRCW060335K7FKEA  [FP-CRCW0603-e3-IPC_C]  (value not drawn)
R13  CRCW060335K7FKEA  [FP-CRCW0603-e3-IPC_C]  (value not drawn)
R14  CRCW060335K7FKEA  [FP-CRCW0603-e3-IPC_C]  (value not drawn)
R15  CRCW060335K7FKEA  [FP-CRCW0603-e3-IPC_C]  (value not drawn)

### Ports
ADC_CH4_CH5_N (out), ADC_CH4_CH5_P (out), ADC_CH6_CH7_N (out), ADC_CH6_CH7_P (out), PGA_C_Out (in), PGA_D_Out (in), SHDN-C (in), SHDN-D (in)

### Nets
+5V: AmpC.3(V+) AmpD.3(V+)
GND: AmpC.6(V-) AmpD.6(V-) C14#2.2 C15#2.2 C16#2.2 C18#2.2 C19#2.2 C21#2.2 R4#2.1 R7#2.1
ADC_CH4_CH5_N: C19#2.1 C20#2.1 R14.2 ; port ADC_CH4_CH5_N
ADC_CH4_CH5_P: C20#2.2 C21#2.1 R15.2 ; port ADC_CH4_CH5_P
ADC_CH6_CH7_N: C17#2.2 C18#2.1 R13.2 ; port ADC_CH6_CH7_N
ADC_CH6_CH7_P: C16#2.1 C17#2.1 R12.2 ; port ADC_CH6_CH7_P
PGA_C_Out: R6#2.1 ; port PGA_C_Out
PGA_D_Out: R5#2.1 ; port PGA_D_Out
SHDN-C: AmpC.7(~{SHDN}) ; port SHDN-C
SHDN-D: AmpD.7(~{SHDN}) ; port SHDN-D
NetAmpC_1: AmpC.1(-IN) R6#2.2 R10.1
NetAmpC_2: AmpC.2(VOCM) C15#2.1
NetAmpC_4: AmpC.4(+OUT) R10.2 R14.1
NetAmpC_5: AmpC.5(-OUT) R11.2 R15.1
NetAmpC_8: AmpC.8(+IN) R7#2.2 R11.1
NetAmpD_1: AmpD.1(-IN) R5#2.2 R9.1
NetAmpD_2: AmpD.2(VOCM) C14#2.1
NetAmpD_4: AmpD.4(+OUT) R9.2 R13.1
NetAmpD_5: AmpD.5(-OUT) R8.2 R12.1
NetAmpD_8: AmpD.8(+IN) R4#2.2 R8.1

### Library data of the parts
AmpC AmpD = CMP-0359-00920-2: as U6#1 on sheet LTC6362_Schematic; PartNumber: LTC6362HMS8#PBF; PackageDescription: 8-Lead Plastic Small Outline, Body 3.9 x 4.9 mm, Pitch 1.27 mm; ComponentLink2Description: Datasheet; ComponentLink3URL: http://cds.linear.com/docs/en/packaging/05081610_G_SO8.pdf; ComponentLink1Description: Manufacturer URL; PackageReference: LT-MS8-8; ComponentLink2URL: http://cds.linear.com/docs/en/datasheet/6362fa.pdf; PackageVersion: Rev G; Mounting Technology: Surface Mount; Linear Technology Part Number: LTC6362; DatasheetVersion: Rev. A; RevisionNote: URLs updated; RoHS: Pb-Free; ComponentLink1URL: http://www.linear.com/; Type: DIFF; ComponentLink3Description: Package Specification
C14#2 C15#2 = CMP-06035-052255-1: as C1A on sheet LTC6362_Schematic; Width: 0.031inch; Length: 1.6mm; Max Operating Temperature: 125°C; Min Operating Temperature: -55°C; Height: 0.7mm; Dielectric: C0G; Termination: SMD/SMT; Depth: 0.8mm; Case/Package: 0603; Package Quantity: 4000; Radiation Hardening: No; Case Code (Metric): 1608; Thickness: 0.031inch; Capacitance: 0.1pF; Case Code (Imperial): 0603; Voltage Rating (DC): 250V; Packaging: Tape and Reel; Mount: Surface Mount
C16#2 C17#2 C18#2 C19#2 C20#2 C21#2 = CMP-03422-000635-2: as C40 on sheet LTC6362_Schematic; Height: 0.8mm; Voltage Rating: 50V; Termination: SMD/SMT; REACH SVHC: No SVHC; Resistor Type: Ceramic; Radiation Hardening: No; Case Code (Imperial): 0603; Voltage: 50V; Series: CC; Mount: Surface Mount; Length: 1.6mm; RoHS Compliant: Yes; Lead Free: Lead Free; Width: 0.8mm; Package Quantity: 4000; Packaging: Tape and Reel; Dielectric: X7R; Voltage Rating (DC): 50V; Min Operating Temperature: -55°C; Depth: 0.8mm; Halogen Free: Halogen Free; Case/Package: 0603; Thickness: 0.035inch; Number of Pins: 2; Max Operating Temperature: 125°C; Case Code (Metric): 1608; Construction: Flat
R4#2 R5#2 R6#2 R7#2 = CMP-2001-04406-1: Manufacturer: Panasonic; Part Number: ERJ-6ENF1241V
R8-R11 = CMP-2100-03671-1: as R22 on sheet LTC6362_Schematic; Number of Pins: 2; Number of Terminations: 2; Datasheet URL: http://www.yageo.com/NewPortal/yageodocoutput?fileName=/pdf/R-Chip/PYu-RC_Group_51_RoHS_L_5.pdf; Length: 0.079inch; Package Description: 2-Pin Surface Mounted Device, Body 2 x 1.25 mm; Depth: 1.25mm; Height: 0.024inch; Military Standard: Not; Case/Package: 0805; Package Reference: 0805; RoHSCompliant: true; Lead Free: LeadFree; Packaging: TapeandReel; Package Quantity: 1; Datasheet Version: Rev. 5, 10/2016; Tolerance: 1%; Min Operating Temperature: -55degC; Voltage Rating: 150V; Composition: ThickFilm; Case Code (Imperial): 0805; Power Rating: 125mW; Width: 0.049inch; Case Code (Metric): 2012; Manufacturer URL: http://www.yageo.com/; Max Operating Temperature: 155degC; REACH SVHC: Unknown; Termination: SMD/SMT
R12-R15 = CMP-2000-03264-2: as R24 on sheet LTC6362_Schematic; Weight: 7.1E-05oz; Termination: Solder; Max Operating Temperature: 155°C; Military Standard: Not; Height: 0.45mm; Temperature Coefficient: 100ppm/°C; Contact Plating: Tin; Packaging: Tape and Reel; Radiation Hardening: No; Depth: 0.85mm; Number of Pins: 2; Length: 1.55mm; Composition: Thick Film; Case Code (Metric): 1608; Package Quantity: 10; Width: 0.033inch; Number of Terminations: 2; Power Rating: 100mW; Case/Package: 0603; Case Code (Imperial): 0603; Features: Automotive AEC-Q200; Tolerance: 1%; Min Operating Temperature: -55°C

## Sheet ADC_PIC32_LVDS_DRIVER_Subsystem.SchDoc
size A; SheetNumber: 2; SheetTotal: 15
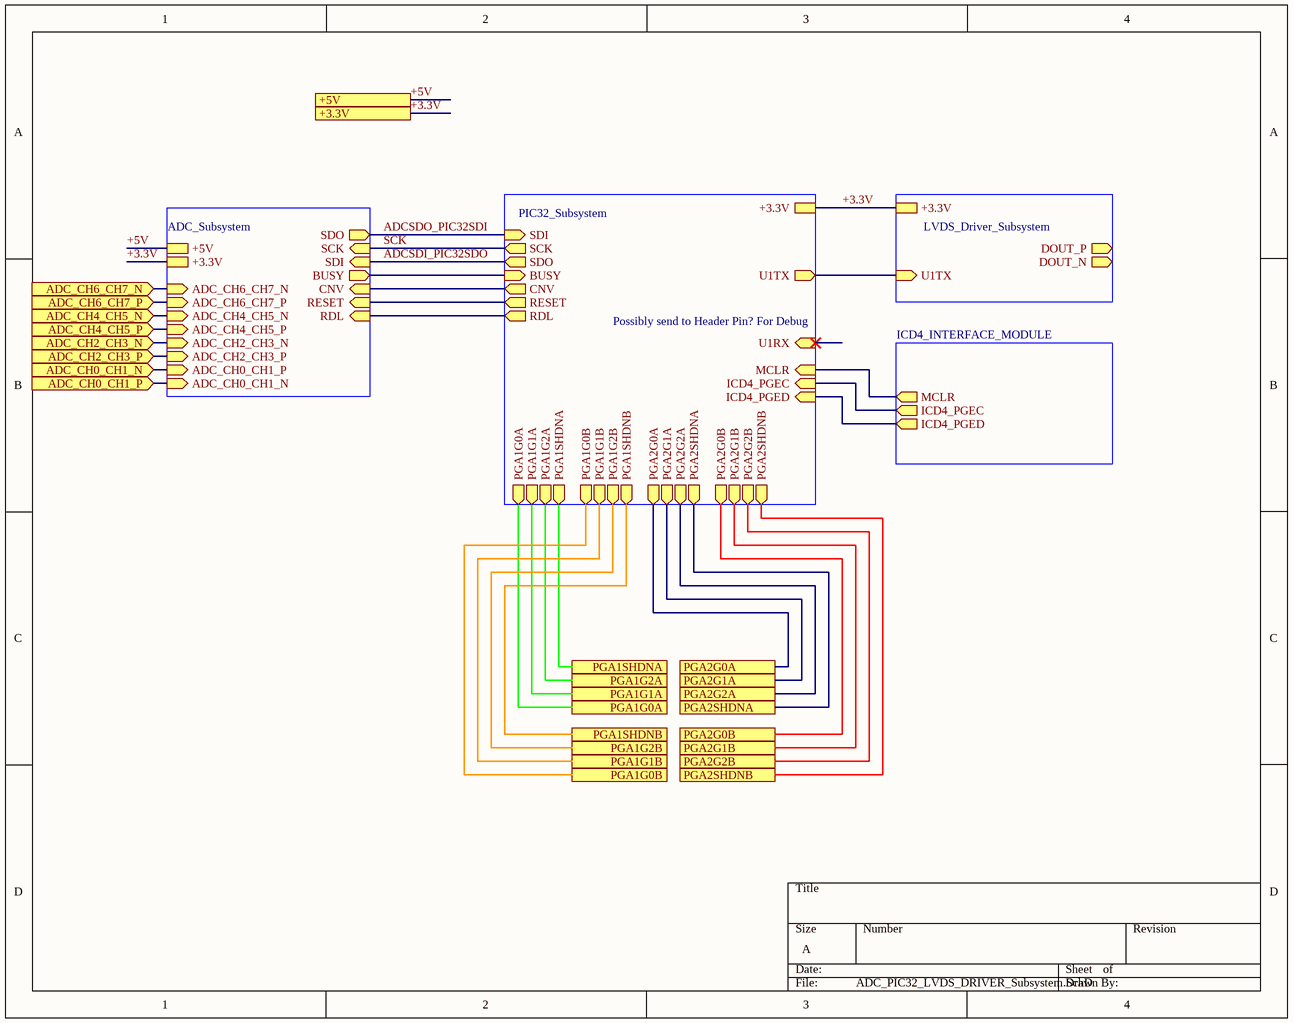
[diagram p6: ADC_PIC32_LVDS_DRIVER_Subsystem.SchDoc]

### Sub-sheets
ADC_Subsystem = ADC_Subsystem.SchDoc: SDO (out), SCK (in), SDI (in), BUSY (out), CNV (in), RESET (in), RDL (in), +5V, +3.3V, ADC_CH6_CH7_N (in), ADC_CH6_CH7_P (in), ADC_CH4_CH5_N (in), ADC_CH4_CH5_P (in), ADC_CH2_CH3_N (in), ADC_CH2_CH3_P (in), ADC_CH0_CH1_P (in), ADC_CH0_CH1_N (in)
ICD4_INTERFACE_MODULE = ICD4_Interface_Module.SchDoc: MCLR (out), ICD4_PGEC (out), ICD4_PGED (out)
LVDS_Driver_Subsystem = LVDS_Driver_Subsystem.SchDoc: DOUT_P (out), DOUT_N (out), U1TX (in), +3.3V
PIC32_Subsystem = PIC32_Subsystem.SchDoc: U1TX (out), U1RX (in), BUSY (in), RESET (out), CNV (out), SDO (out), SCK (out), SDI (in), RDL (out), ICD4_PGED (in), ICD4_PGEC (in), MCLR (in), PGA1G0A (out), PGA1G1A (out), PGA1G2A (out), PGA1SHDNA (out), PGA1G0B (out), PGA1G1B (out), PGA1G2B (out), PGA1SHDNB (out), PGA2G0A (out), PGA2G1A (out), PGA2G2A (out), PGA2SHDNA (out), PGA2G0B (out), PGA2G1B (out), PGA2G2B (out), PGA2SHDNB (out), +3.3V

### Ports
+3.3V, +5V, ADC_CH0_CH1_N (in), ADC_CH0_CH1_P (in), ADC_CH2_CH3_N (in), ADC_CH2_CH3_P (in), ADC_CH4_CH5_N (in), ADC_CH4_CH5_P (in), ADC_CH6_CH7_N (in), ADC_CH6_CH7_P (in), PGA1G0A, PGA1G0B, PGA1G1A, PGA1G1B, PGA1G2A, PGA1G2B, PGA1SHDNA, PGA1SHDNB, PGA2G0A, PGA2G0B, PGA2G1A, PGA2G1B, PGA2G2A, PGA2G2B, PGA2SHDNA, PGA2SHDNB

### Nets
+3.3V: port +3.3V, sheet ADC_Subsystem/+3.3V, sheet PIC32_Subsystem/+3.3V, sheet LVDS_Driver_Subsystem/+3.3V
+5V: port +5V, sheet ADC_Subsystem/+5V
A_GP0: port PGA2G0A, sheet PIC32_Subsystem/PGA2G0A
A_GP1: port PGA2G1A, sheet PIC32_Subsystem/PGA2G1A
A_GP2: port PGA2G2A, sheet PIC32_Subsystem/PGA2G2A
ADC_CH0_CH1_N: port ADC_CH0_CH1_P, sheet ADC_Subsystem/ADC_CH0_CH1_N
ADC_CH0_CH1_P: port ADC_CH0_CH1_N, sheet ADC_Subsystem/ADC_CH0_CH1_P
ADC_CH2_CH3_N: port ADC_CH2_CH3_N, sheet ADC_Subsystem/ADC_CH2_CH3_N
ADC_CH2_CH3_P: port ADC_CH2_CH3_P, sheet ADC_Subsystem/ADC_CH2_CH3_P
ADC_CH4_CH5_N: port ADC_CH4_CH5_N, sheet ADC_Subsystem/ADC_CH4_CH5_N
ADC_CH4_CH5_P: port ADC_CH4_CH5_P, sheet ADC_Subsystem/ADC_CH4_CH5_P
ADC_CH6_CH7_N: port ADC_CH6_CH7_N, sheet ADC_Subsystem/ADC_CH6_CH7_N
ADC_CH6_CH7_P: port ADC_CH6_CH7_P, sheet ADC_Subsystem/ADC_CH6_CH7_P
ADCSDI_PIC32SDO: sheet ADC_Subsystem/SDI, sheet PIC32_Subsystem/SDO
ADCSDO_PIC32SDI: sheet ADC_Subsystem/SDO, sheet PIC32_Subsystem/SDI
B_GP0: port PGA2G0B, sheet PIC32_Subsystem/PGA2G0B
B_GP1: port PGA2G1B, sheet PIC32_Subsystem/PGA2G1B
B_GP2: port PGA2G2B, sheet PIC32_Subsystem/PGA2G2B
C_GP0: port PGA1G0B, sheet PIC32_Subsystem/PGA1G0B
C_GP1: port PGA1G1B, sheet PIC32_Subsystem/PGA1G1B
C_GP2: port PGA1G2B, sheet PIC32_Subsystem/PGA1G2B
D_GP0: port PGA1G0A, sheet PIC32_Subsystem/PGA1G0A
D_GP1: port PGA1G1A, sheet PIC32_Subsystem/PGA1G1A
D_GP2: port PGA1G2A, sheet PIC32_Subsystem/PGA1G2A
MCLR: sheet PIC32_Subsystem/MCLR, sheet ICD4_INTERFACE_MODULE/MCLR
PGC: sheet PIC32_Subsystem/ICD4_PGEC, sheet ICD4_INTERFACE_MODULE/ICD4_PGEC
PGD: sheet PIC32_Subsystem/ICD4_PGED, sheet ICD4_INTERFACE_MODULE/ICD4_PGED
SCK: sheet ADC_Subsystem/SCK, sheet PIC32_Subsystem/SCK
SHDN-A: port PGA2SHDNA, sheet PIC32_Subsystem/PGA2SHDNA
SHDN-B: port PGA2SHDNB, sheet PIC32_Subsystem/PGA2SHDNB
SHDN-C: port PGA1SHDNB, sheet PIC32_Subsystem/PGA1SHDNB
SHDN-D: port PGA1SHDNA, sheet PIC32_Subsystem/PGA1SHDNA
UART_TX: sheet PIC32_Subsystem/U1TX, sheet LVDS_Driver_Subsystem/U1TX
NetU1_46: sheet ADC_Subsystem/RESET, sheet PIC32_Subsystem/RESET
NetU1_53: sheet ADC_Subsystem/BUSY, sheet PIC32_Subsystem/BUSY
NetU1_54: sheet ADC_Subsystem/RDL, sheet PIC32_Subsystem/RDL
NetU1_55: sheet ADC_Subsystem/CNV, sheet PIC32_Subsystem/CNV

### Notes on the sheet
- Possibly send to Header Pin? For Debug

## Sheet ADC_Subsystem.SchDoc
size A; SheetNumber: 7; SheetTotal: 16
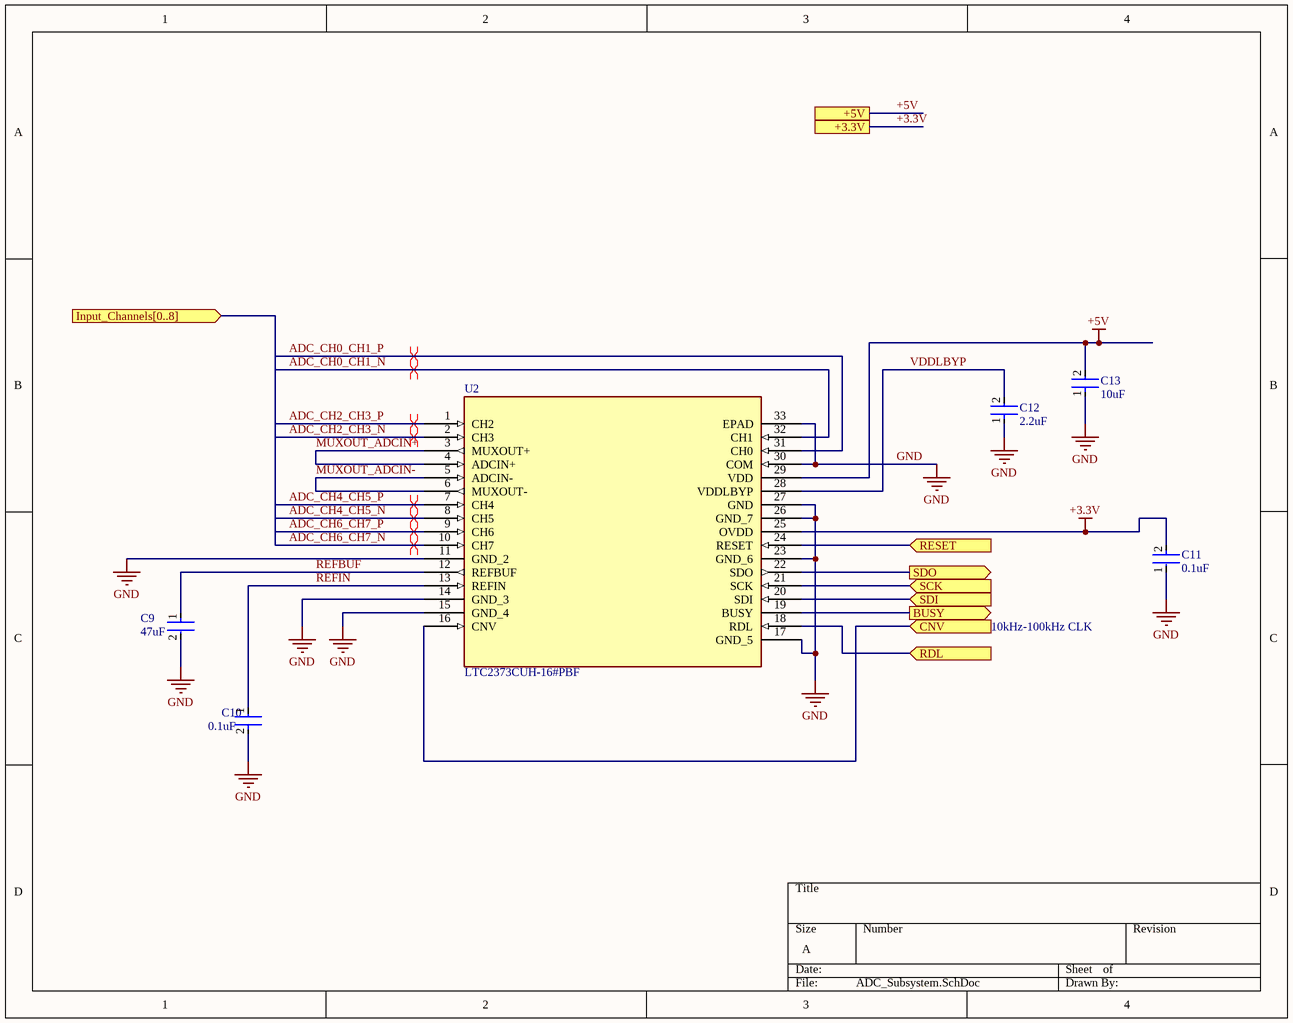
[diagram p7: ADC_Subsystem.SchDoc]

### Parts
C9  47uF  [FP-C0805C476M9PACTU-MFG]
C10  0.1uF  [FP-GRM15-MFG]
C11  0.1uF  [FP-GRM15-MFG]
C12  2.2uF  [FP-GRM188-0_1-e0_2_0_5-MFG]
C13  10uF  [FP-GRM188-0_1-e0_2_0_55-IPC_A]
U2  LTC2373CUH-16#PBF  [LTC_2373_Footprint]

### Ports
+3.3V, +5V, BUSY (out), CNV (in), Input_Channels[0..8] (in), RDL (in), RESET (in), SCK (in), SDI (in), SDO (out)

### Nets
+3.3V: C11.2 U2.25(OVDD) ; port +3.3V
+5V: C13.2 U2.29(VDD) ; port +5V
GND: C9.2 C10.2 C11.1 C12.1 C13.1 U2.11(GND_2) U2.14(GND_3) U2.15(GND_4) U2.17(GND_5) U2.23(GND_6) U2.26(GND_7) U2.27(GND) U2.30(COM) U2.33(EPAD)
ADC_CH0_CH1_N: U2.32(CH1)
ADC_CH0_CH1_P: U2.31(CH0)
ADC_CH2_CH3_N: U2.2(CH3)
ADC_CH2_CH3_P: U2.1(CH2)
ADC_CH4_CH5_N: U2.8(CH5)
ADC_CH4_CH5_P: U2.7(CH4)
ADC_CH6_CH7_N: U2.10(CH7)
ADC_CH6_CH7_P: U2.9(CH6)
ADCSDI_PIC32SDO: U2.20(SDI) ; port SDI
ADCSDO_PIC32SDI: U2.22(SDO) ; port SDO
MUXOUT_ADCIN+: U2.3(MUXOUT+) U2.4(ADCIN+)
MUXOUT_ADCIN-: U2.5(ADCIN-) U2.6(MUXOUT-)
REFBUF: C9.1 U2.12(REFBUF)
REFIN: C10.1 U2.13(REFIN)
SCK: U2.21(SCK) ; port SCK
VDDLBYP: C12.2 U2.28(VDDLBYP)
NetU1_46: U2.24(RESET) ; port RESET
NetU1_53: U2.19(BUSY) ; port BUSY
NetU1_54: U2.18(RDL) ; port RDL
NetU1_55: U2.16(CNV) ; port CNV

### Layout directives
differential pair: ADC_CH0_CH1_N, ADC_CH0_CH1_P, ADC_CH2_CH3_N, ADC_CH2_CH3_P, ADC_CH4_CH5_N, ADC_CH4_CH5_P, ADC_CH6_CH7_N, ADC_CH6_CH7_P

### Notes on the sheet
- 10kHz-100kHz CLK

### Library data of the parts
C9 = CMP-2007-01008-2: CAP CER 47UF 6.3V X5R 0805 / C0805C476M9PACTU; Dielectric Material: Ceramic; Dissipation Factor: 5%; Tolerance: 20%; Case Code (Imperial): 0805; Mount: PCB; Width: 1.2mm; Package Quantity: 3000; Radiation Hardening: No; Packaging: Tape and Reel; Termination: SMD/SMT; Series: C0805C; Voltage: 6.3V; Depth: 1.25mm; Dielectric: X5R; Case Code (Metric): 2012; Length: 2mm; Case/Package: 0805; REACH SVHC: No SVHC; Voltage Rating (DC): 6.3V; Capacitance: 47uF; RoHS Compliant: Yes; Height: 1.25mm; Construction: Flat; Number of Pins: 2; Voltage Rating: 6.3V; Max Operating Temperature: 85°C; Min Operating Temperature: -55°C
C10 C11 = CMP-2100-03641-2: CAP CER 0.1UF 16V X7R 0402 / GRM155R71C104KA88D; Manufacturer: Murata; Standoff Height: 0mm; Tolerance: 10%; Voltage Rating: 16Vdc; Material: Ceramic; Capacitance: 0.10μF; Value: 0.10μF; RoHS: TRUE; Manufacturer Part Number: GRM155R71C104KA88D; Temperature Characteristic: X7R; Octopart: https://octopart.com/grm155r71c104ka88d-murata-196880; Digikey Description: CAP CER 0.1UF 16V X7R 0402; Device Class L3: Ceramic Capacitors; Height: 0.55mm; ComponentLink2Description: Datasheet; Temperature Range Low: -55°C; Ipc Land Pattern Name: CAPC10050X219; ComponentLink2URL: https://search.murata.co.jp/Ceramy/image/img/A01X/G101/ENG/GRM155R71H471KA01-01A.pdf; Device Class L1: Passive Components; Lead Free: yes; Category: Cap; Package: GRM15; Temperature: -55°C to +125°C; Device Class L2: Capacitors; Temperature Range High: +125°C; Mouser Description: 0402 0.1 uF 16V ±10 % Tolerance X7R SMT Multilayer Ceramic Capacitor
C12 = CMP-2006-02836-2: Chip Multilayer Ceramic Capacitors for General Purpose, 0603, 2.2uF, X7R, 15%, 10%, 10V / GRM188R71A225KE15D; Case Code (Metric): 1608; Height: 0.8mm; Packaging: Cut Tape; Voltage: 10V; Lead Free: Lead Free; Min Operating Temperature: -55°C; Voltage Rating (DC): 10V; Max Operating Temperature: 125°C; Voltage Rating: 10V; Dielectric: X7R; Depth: 0.8mm; Case Code (Imperial): 0603; Termination: SMD/SMT; Case/Package: 0603; Number of Pins: 2; REACH SVHC: No SVHC; Mount: Surface Mount; Width: 0.031inch; Material: Ceramic; Capacitance: 2.2uF; Package Quantity: 1; Weight: 7.1E-05oz; Length: 1.6mm; Thickness: 0.035inch; Tolerance: 10%
C13 = CMP-2006-02792-2: Chip Multilayer Ceramic Capacitors for General Purpose, 0603, 10uF, X5R, 15%, 20%, 6.3V / GRM188R60J106ME47D; Packaging: Tape and Reel; Voltage Rating (DC): 6.3V; Width: 0.031inch; Termination: SMD/SMT; Dielectric: X5R; Package Quantity: 4000; Voltage Rating: 6.3V; Capacitance: 10uF; Case/Package: 0603; Min Operating Temperature: -55°C; Voltage: 6.3V; Length: 1.6mm; Thickness: 0.035inch; Lead Free: Lead Free; Depth: 0.8mm; Case Code (Imperial): 0603; Max Operating Temperature: 85°C; Material: Ceramic; Height: 0.8mm; Tolerance: 20%; Mount: Surface Mount; REACH SVHC: No SVHC; Radiation Hardening: No; Case Code (Metric): 1608

## Sheet PIC32_Subsystem.SchDoc
size A; SheetNumber: 4; SheetTotal: 15
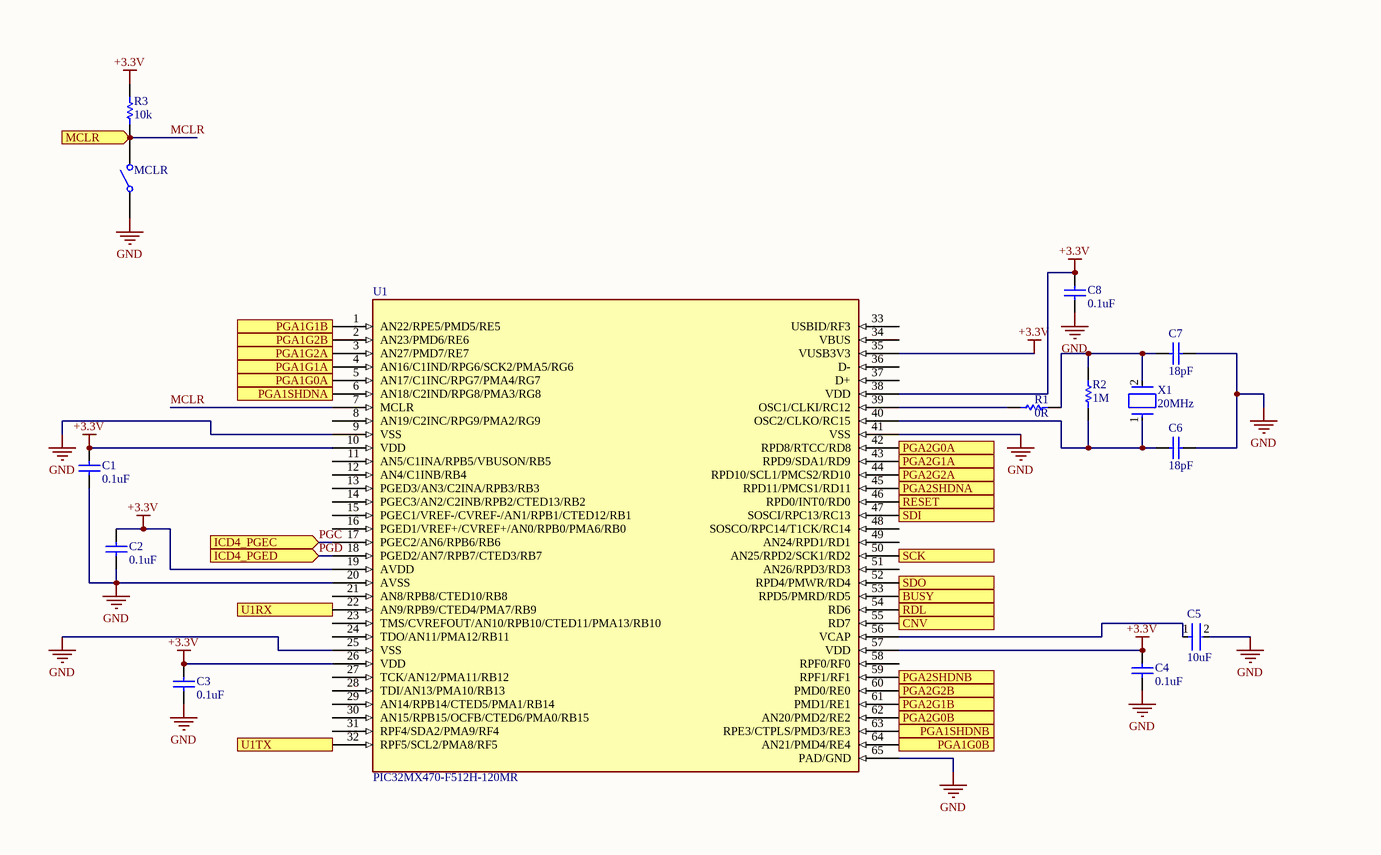
[diagram p8: PIC32_Subsystem.SchDoc, left]

### Parts
C1  0.1uF  [CAPC1050X55X23ML05T13]
C2  0.1uF  [CAPC1050X55X23ML05T13]
C3  0.1uF  [CAPC1050X55X23ML05T13]
C4  0.1uF  [CAPC1050X55X23ML05T13]
C5  10uF  [FP-GRM188-0_1-e0_2_0_55-IPC_A]
C6  18pF  [CAPC1005X55X25LL05T10]
C7  18pF  [CAPC1005X55X25LL05T10]
C8  0.1uF  [CAPC1050X55X23ML05T13]
MCLR  434121043816  [434121043816]  (value not drawn)
R1  0R  [RESC1005X40X25NL05T10]
R2  1M  [RESC1005X40X25LL05T05]
R3  10k  [RESC1005X40X25LL05T05]
U1  PIC32MX470-F512H-120MR  [QFN50P900X900X100-65N]
X1  20MHz  [FP-ABM7-MFG]

### Ports
BUSY (in), CNV (out), ICD4_PGEC (in), ICD4_PGED (in), MCLR (in), PGA1G0A (out), PGA1G0B (out), PGA1G1A (out), PGA1G1B (out), PGA1G2A (out), PGA1G2B (out), PGA1SHDNA (out), PGA1SHDNB (out), PGA2G0A (out), PGA2G0B (out), PGA2G1A (out), PGA2G1B (out), PGA2G2A (out), PGA2G2B (out), PGA2SHDNA (out), PGA2SHDNB (out), RDL (out), RESET (out), SCK (out), SDI (in), SDO (out), U1RX (in), U1TX (out)

### Nets
+3.3V: C1.2 C2.2 C3.2 C4.2 C8.2 R3.2 U1.10(VDD) U1.19(AVDD) U1.26(VDD) U1.35(VUSB3V3) U1.38(VDD) U1.57(VDD)
GND: C1.1 C2.1 C3.1 C4.1 C5.2 C6.2 C7.2 C8.1 MCLR.1 U1.9(VSS) U1.20(AVSS) U1.25(VSS) U1.41(VSS) U1.65(PAD/GND)
A_GP0: U1.42(RPD8/RTCC/RD8) ; port PGA2G0A
A_GP1: U1.43(RPD9/SDA1/RD9) ; port PGA2G1A
A_GP2: U1.44(RPD10/SCL1/PMCS2/RD10) ; port PGA2G2A
ADCSDI_PIC32SDO: U1.52(RPD4/PMWR/RD4) ; port SDO
ADCSDO_PIC32SDI: U1.47(SOSCI/RPC13/RC13) ; port SDI
B_GP0: U1.62(AN20/PMD2/RE2) ; port PGA2G0B
B_GP1: U1.61(PMD1/RE1) ; port PGA2G1B
B_GP2: U1.60(PMD0/RE0) ; port PGA2G2B
C_GP0: U1.64(AN21/PMD4/RE4) ; port PGA1G0B
C_GP1: U1.1(AN22/RPE5/PMD5/RE5) ; port PGA1G1B
C_GP2: U1.2(AN23/PMD6/RE6) ; port PGA1G2B
D_GP0: U1.5(AN17/C1INC/RPG7/PMA4/RG7) ; port PGA1G0A
D_GP1: U1.4(AN16/C1IND/RPG6/SCK2/PMA5/RG6) ; port PGA1G1A
D_GP2: U1.3(AN27/PMD7/RE7) ; port PGA1G2A
MCLR: MCLR.2 R3.1 U1.7(MCLR) ; port MCLR
PGC: U1.17(PGEC2/AN6/RPB6/RB6) ; port ICD4_PGEC
PGD: U1.18(PGED2/AN7/RPB7/CTED3/RB7) ; port ICD4_PGED
SCK: U1.50(AN25/RPD2/SCK1/RD2) ; port SCK
SHDN-A: U1.45(RPD11/PMCS1/RD11) ; port PGA2SHDNA
SHDN-B: U1.59(RPF1/RF1) ; port PGA2SHDNB
SHDN-C: U1.63(RPE3/CTPLS/PMD3/RE3) ; port PGA1SHDNB
SHDN-D: U1.6(AN18/C2IND/RPG8/PMA3/RG8) ; port PGA1SHDNA
UART_TX: U1.32(RPF5/SCL2/PMA8/RF5) ; port U1TX
NetC5_1: C5.1 U1.56(VCAP)
NetC6_1: C6.1 R2.1 U1.40(OSC2/CLKO/RC15) X1.1
NetC7_1: C7.1 R1.2 R2.2 X1.2
NetR1_1: R1.1 U1.39(OSC1/CLKI/RC12)
NetU1_22: U1.22(AN9/RPB9/CTED4/PMA7/RB9) ; port U1RX
NetU1_46: U1.46(RPD0/INT0/RD0) ; port RESET
NetU1_53: U1.53(RPD5/PMRD/RD5) ; port BUSY
NetU1_54: U1.54(RD6) ; port RDL
NetU1_55: U1.55(RD7) ; port CNV

Not connected (* = marked no-connect by the designer): U1 8(AN19/C2INC/RPG9/PMA2/RG9) 11(AN5/C1INA/RPB5/VBUSON/RB5) 12(AN4/C1INB/RB4) 13(PGED3/AN3/C2INA/RPB3/RB3) 14(PGEC3/AN2/C2INB/RPB2/CTED13/RB2) 15(PGEC1/VREF-/CVREF-/AN1/RPB1/CTED12/RB1) 16(PGED1/VREF+/CVREF+/AN0/RPB0/PMA6/RB0) 21(AN8/RPB8/CTED10/RB8) 23(TMS/CVREFOUT/AN10/RPB10/CTED11/PMA13/RB10) 24(TDO/AN11/PMA12/RB11) 27(TCK/AN12/PMA11/RB12) 28(TDI/AN13/PMA10/RB13) 29(AN14/RPB14/CTED5/PMA1/RB14) 30(AN15/RPB15/OCFB/CTED6/PMA0/RB15) 31(RPF4/SDA2/PMA9/RF4) 33(USBID/RF3) 34(VBUS) 36(D-) 37(D+) 48(SOSCO/RPC14/T1CK/RC14) 49(AN24/RPD1/RD1) 51(AN26/RPD3/RD3) 58(RPF0/RF0)

### Library data of the parts
C1-C4 C8 = CMP-2000-05439-1: Chip Capacitor, 100 nF, +/- 10%, 16 V, -55 to 125 degC, 0402 (1005 Metric), RoHS, Tape and Reel / CL05B104KO5NNNC; Manufacturer: Samsung Electro-Mechanics; Capacitance: 100000pF; Dielectric: X7R; Rated Voltage: 16V; Case Size/Dimension: 0402; Tolerance (%): ±10%; Manufacturer URL: http://www.samsungsem.com/global/index.jsp; Datasheet URL: https://datasheet.ciiva.com/29198/458718-da-01-en-vs-kondensator-0402-29198423.pdf; Datasheet Version: Nov-10
C5 = CMP-2006-02792-2: as C13 on sheet ADC_Subsystem; Packaging: Tape and Reel; Voltage Rating (DC): 6.3V; Width: 0.031inch; Termination: SMD/SMT; Dielectric: X5R; Package Quantity: 4000; Voltage Rating: 6.3V; Capacitance: 10uF; Case/Package: 0603; Min Operating Temperature: -55°C; Voltage: 6.3V; Length: 1.6mm; Thickness: 0.035inch; Lead Free: Lead Free; Depth: 0.8mm; Case Code (Imperial): 0603; Max Operating Temperature: 85°C; Material: Ceramic; Height: 0.8mm; Tolerance: 20%; Mount: Surface Mount; REACH SVHC: No SVHC; Radiation Hardening: No; Case Code (Metric): 1608
C6 C7 = CMP-2008-04271-1: GRM1555C1H180GA01D; Manufacturer: Murata; Part Number: GRM1555C1H180GA01D
MCLR = CMP-1459-00005-1: WS-TASV SMD Tact Switch 6.0X3.5 mm; Manufacturer: Wuerth Elektronik; NoPins: 02; ComponentLink1URL: http://www.we-online.com; PartNumber: 434121043816; ComponentLink2URL: http://katalog.we-online.de/em/datasheet/434121043816.pdf; ComponentLink2Description: Datasheet; ComponentLink1Description: Manufacturer URL; PackageReference: 434121043816
R1 = CMP-1011-00001-2: RC0402JR-070RL; Manufacturer: Yageo / Phycomp; Part Number: RC0402JR-070RL
R2 = CMP-2002-00609-3: Chip Resistor, 1 MOhm, +/- 1%, 100 mW, -55 to 155 degC, 0402 (1005 Metric), RoHS, Tape and Reel / ERJ-2RKF1004X; Manufacturer: Basic Passives; Voltage Rating: 50 V; Case\/Package: 0402; Resistance: 1 MOhm; Power Rating: 100 mW; Pins: 2; Max Operating Temperature: 155 degC; ComponentLink2URL: http://industrial.panasonic.com/cdbs/www-data/pdf/RDA0000/AOA0000C86.pdf; Weight: 2.8E-05oz; ComponentLink1URL: http://www.panasonic.com/; Radiation Hardening: No; Height: 0.35 mm; Case Code (Imperial): 0402; ComponentLink2Description: Datasheet; Mount: Surface Mount; ComponentLink1Description: Manufacturer URL; REACH SVHC: Yes; PartNumber: ERJ-2RKF1004X; Length: 1 mm; Min Operating Temperature: -55 degC; Width: 0.5 mm; Package Quantity: 10000; Tolerance: 1%; PackageDescription: 2-Pin Surface Mount Device, Body 1 x 0.5 mm; RoHSCompliant: true; DatasheetVersion: 04/2015; PackageReference: 0402; Mounting Technology: Surface Mount; Case Code (Metric): 1005; Packaging: Tape and Reel
R3 = CMP-2000-07588-1: Chip Resistor, 10 KOhm, +/- 1%, 0.1 W, -55 to 155 degC, 0402 (1005 Metric), RoHS, Tape and Reel / ERJ2RKF1002X; Manufacturer: Panasonic; Power Rating: 100mW; Voltage Rating: 50V; Resistance: 10KOhm; Case\/Package: 0402; Temperature Coefficient: 100ppm\/degreesC; RoHSCompliant: True; Lead Free: LeadFree; Package Quantity: 1; Contact Plating: Tin; Length: 1mm; Radiation Hardening: No; REACH SVHC: NoSVHC; Max Operating Temperature: 155degC; Depth: 0.5mm; Case Code (Imperial): 0402; Military Standard: Not; Package Description: 2-Pin Surface Mount Device, Body 1 x 0.5 mm; Termination: SMD/SMT; Case Code (Metric): 1005; Height: 0.35mm; Packaging: TapeandReel; Voltage Rating (DC): 50V; Package Reference: 402; Number of Pins: 2; Tolerance: 1%; Mounting Technology: SurfaceMount; Width: 0.02inch; Mount: SurfaceMount; Datasheet URL: https://industrial.panasonic.com/cdbs/www-data/pdf/RDA0000/AOA0000C304.pdf; Composition: ThickFilm; Datasheet Version: 02/2017; Manufacturer URL: http://www.panasonic.com/; Max Power Dissipation: 100mW; Number of Terminations: 2; Min Operating Temperature: -55degC
X1 = CMP-27762-013587-1: Crystal 20MHz ±20ppm 18pF SMD-2 6mm x 3.5mm / ABM7-20.000MHZ-D2Y-T; Frequency Stability: 30ppm; ESR (Equivalent Series Resistance): 50R; Contact Plating: Gold; Load Capacitance: 18pF; Tolerance: 20ppm; Length: 6mm; Frequency: 20MHz; Lead Free: Lead Free; Package Quantity: 1000; Resistor Type: Ceramic; Min Operating Temperature: -40°C; Max Operating Temperature: 85°C; Series: ABM7; Depth: 3.5mm; Width: 0.138inch; Frequency Tolerance: 20ppm; Termination: SMD/SMT; Radiation Hardening: No; Case/Package: CSMD; Height: 0.055inch; Packaging: Tape and Reel; Operating Frequency: 20 MHz; Series Resistance: 50R; Number of Pins: 2; Mount: Surface Mount

## Sheet LVDS_Driver_Subsystem.SchDoc
size A; SheetNumber: 5; SheetTotal: 16
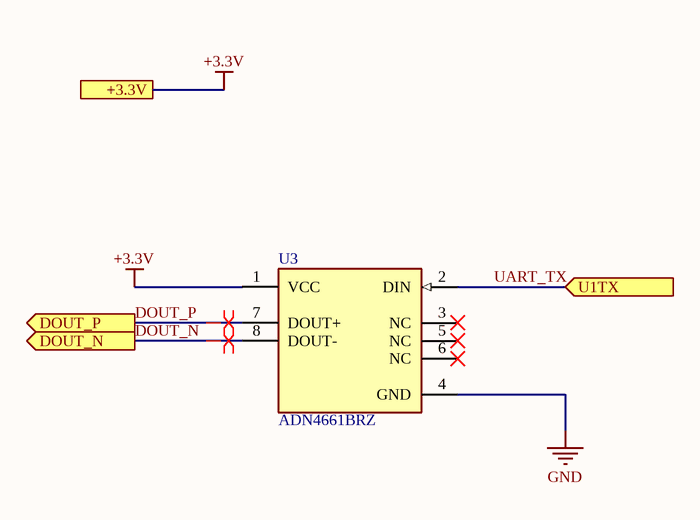
[diagram p9: LVDS_Driver_Subsystem.SchDoc]

### Parts
U3  ADN4661BRZ  [FP-R-8-IPC_A]

### Ports
+3.3V, DOUT_N (out), DOUT_P (out), U1TX (in)

### Nets
+3.3V: U3.1(VCC) ; port +3.3V
GND: U3.4(GND)
DOUT_N: U3.8(DOUT-) ; port DOUT_N
DOUT_P: U3.7(DOUT+) ; port DOUT_P
UART_TX: U3.2(DIN) ; port U1TX

Not connected (* = marked no-connect by the designer): U3 3(NC)* 5(NC)* 6(NC)*

### Layout directives
differential pair: DOUT_N, DOUT_P

### Library data of the parts
U3 = CMP-09093-000114-1: IC DRIVER 1/0 8SOIC; Supply Current: 7mA; Number of Receivers: 1; Min Supply Voltage: 3V; Max Supply Current: 10mA; Max Supply Voltage: 3.6V; Turn-On Delay Time: 1.5ns; Data Rate: 600Mbps; Operating Supply Voltage: 3.3V; Length: 5mm; Series: -; Number of Pins: 8; REACH SVHC: No SVHC; Mount: Surface Mount; RoHS Compliant: Yes; Packaging: Rail/Tube; Nominal Supply Current: 7mA; Radiation Hardening: No; Number of Drivers: 1; Width: 4mm; Number of Elements: 1; Lead Free: Contains Lead; Operating Supply Current: 7mA; Min Operating Temperature: -40°C; Propagation Delay: 1.5ns; Package Quantity: 98; Height: 1.5mm; Case/Package: SOIC; Max Operating Temperature: 85°C